# EAGLE design QuadStepDriver (EAGLE 6.4)

## Sheet 1 of 5
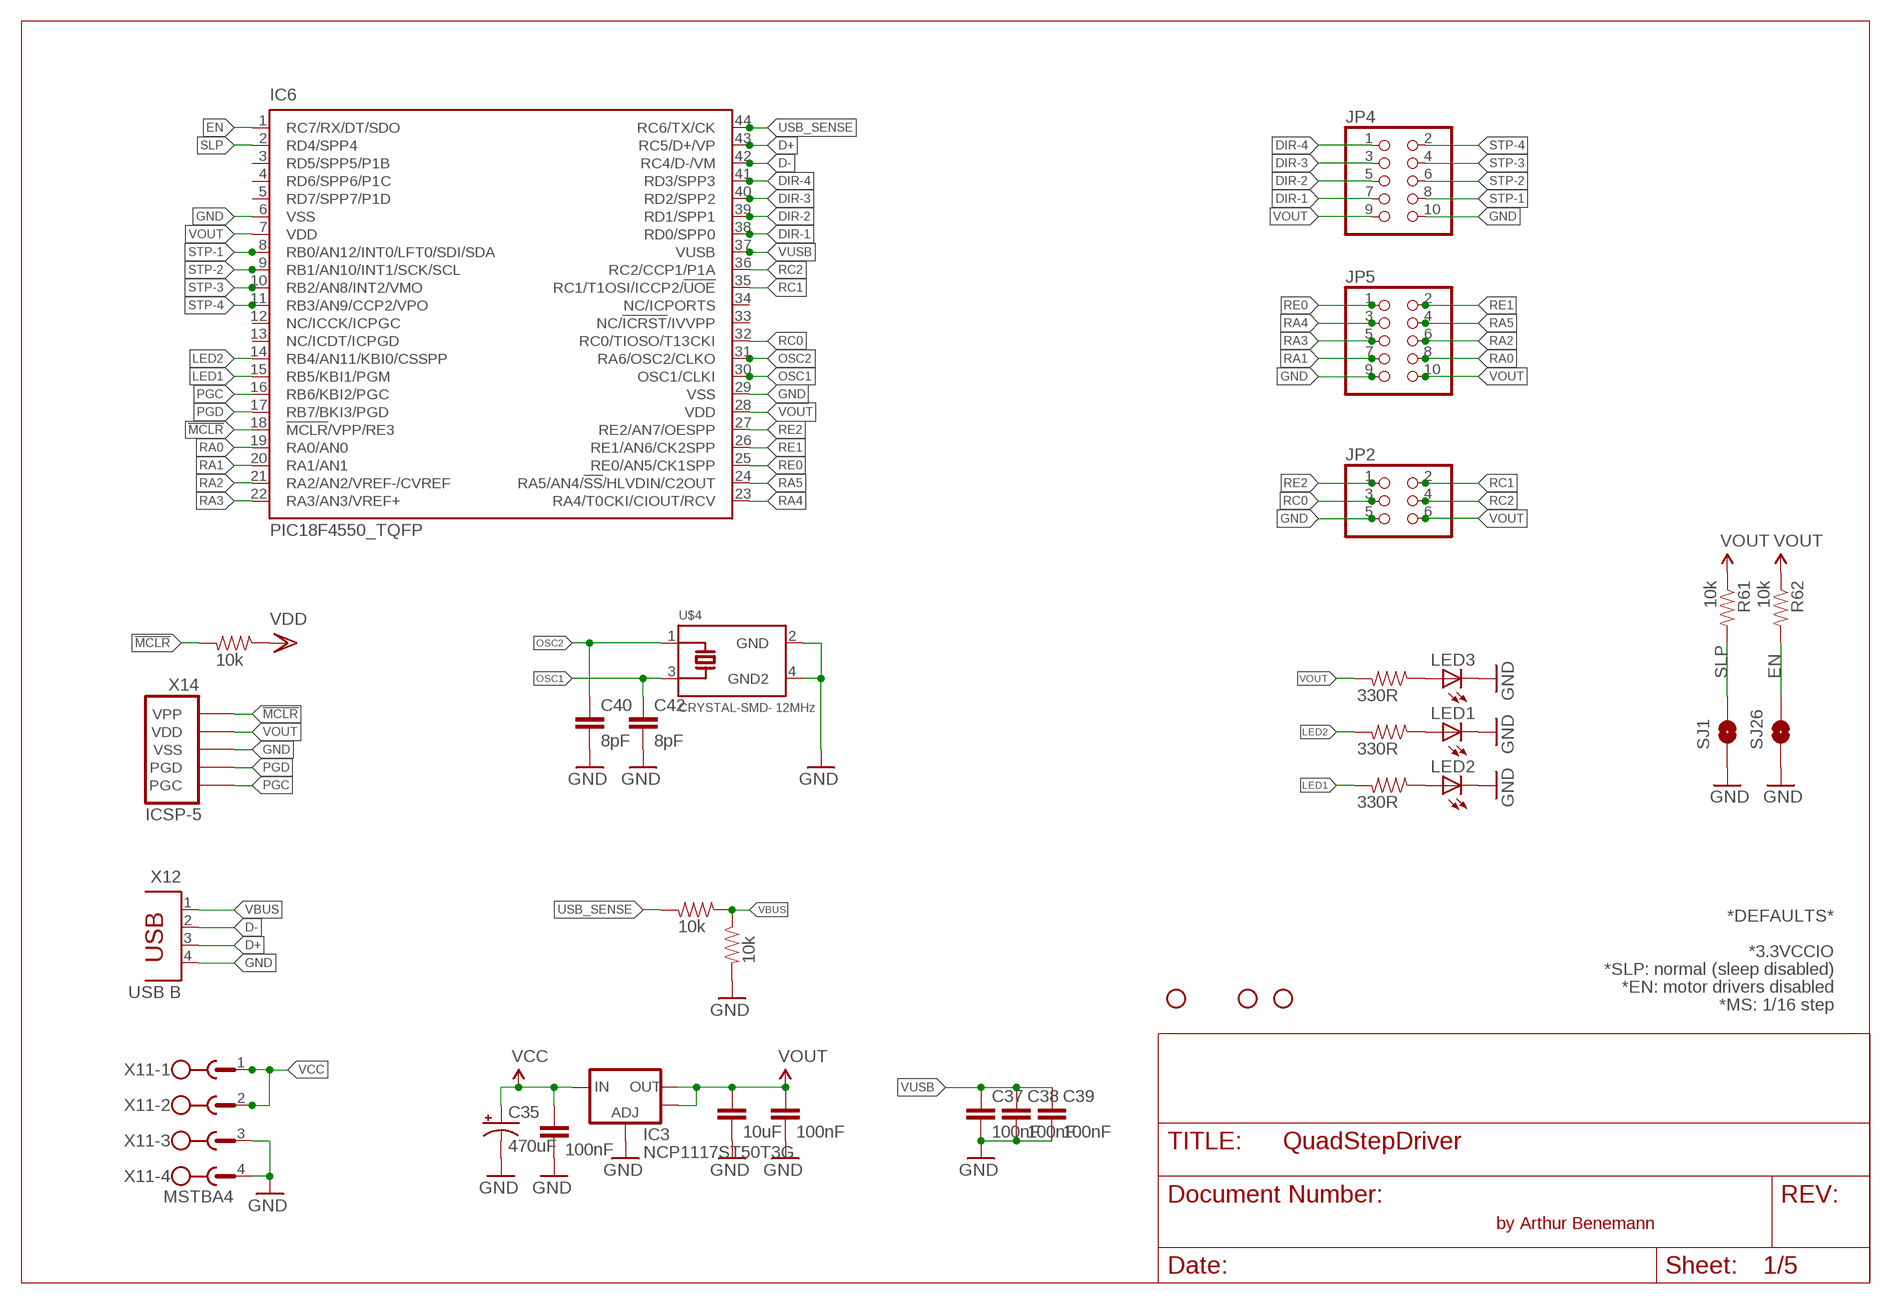
[diagram p0: schematic, sheet 1]

### Parts
C33  10uF  CAP0805  [0805]
C34  100nF  CAP0805  [0805]
C35  470uF  CAP_POLG  [PANASONIC_G]
C36  100nF  CAP0805  [0805]
C37  100nF  CAP0805  [0805]
C38  100nF  CAP0805  [0805]
C39  100nF  CAP0805  [0805]
C40  8pF  CAP0603-CAP  [0603-CAP]
C42  8pF  CAP0603-CAP  [0603-CAP]
IC3  NCP1117ST50T3G  V_REG_LM1117SOT223  [SOT223]
IC6  PIC18F4550_TQFP  [TQFP44]
JP2  PINHD-2X3  [2X03]
JP4  PINHD-2X5  [2X05]
JP5  PINHD-2X5  [2X05]
JP9  STAND-OFF  [STAND-OFF]
JP10  STAND-OFF  [STAND-OFF]
JP12  STAND-OFF  [STAND-OFF]
LED1  LEDCHIPLED_0805  [CHIPLED_0805]
LED2  LEDCHIPLED_0805  [CHIPLED_0805]
LED3  LEDCHIPLED_0805  [CHIPLED_0805]
R33  330R  RESISTOR  [0805]
R34  330R  RESISTOR  [0805]
R35  330R  RESISTOR  [0805]
R49  10k  RESISTOR  [0805]
R50  10k  RESISTOR  [0805]
R51  10k  RESISTOR  [0805]
R61  10k  RESISTOR0603-RES  [0603-RES]
R62  10k  RESISTOR0603-RES  [0603-RES]
SJ1  SOLDERJUMPERNO  [SJ_2S-NO]
SJ26  SOLDERJUMPERNO  [SJ_2S-NO]
U$4  CRYSTAL-SMD- 12MHz  CRYSTAL-SMD  [CRYSTAL-SMD-3.2X2.5]
X11  MSTBA4  [MSTBA4]
X12  USB B  PN61729  [PN61729]
X14  ICSP-5  [M05]

### Nets
!MCLR: IC6.18(!MCLR!/VPP/RE3) R51.2 X14.1(VPP)
D+: IC6.43(RC5/D+/VP) X12.3
D-: IC6.42(RC4/D-/VM) X12.2
DIR-1: IC6.38(RD0/SPP0) JP4.7 ; also sheet 2
DIR-2: IC6.39(RD1/SPP1) JP4.5 ; also sheet 3
DIR-3: IC6.40(RD2/SPP2) JP4.3 ; also sheet 4
DIR-4: IC6.41(RD3/SPP3) JP4.1 ; also sheet 5
EN: IC6.1(RC7/RX/DT/SDO) R62.2 SJ26.2 ; also sheet 2,3,4,5
GND: C33.1 C34.1 C35.- C36.1 C37.2 C38.2 C39.2 C40.2 C42.2 IC3.1(ADJ) IC6.6(VSS) IC6.29(VSS) JP2.5 JP4.10 JP5.9 LED1.C LED2.C LED3.C R50.2 SJ1.1 SJ26.1 U$4.2(GND) U$4.4(GND2) X11.3 X11.4 X12.4 X14.3(VSS) ; also sheet 2,3,4,5
LED1: IC6.15(RB5/KBI1/PGM) R34.2
LED2: IC6.14(RB4/AN11/KBI0/CSSPP) R33.2
N$27: LED3.A R35.1
N$54: LED1.A R33.1
N$73: LED2.A R34.1
OSC1: C42.1 IC6.30(OSC1/CLKI) U$4.3(OSC2)
OSC2: C40.1 IC6.31(RA6/OSC2/CLKO) U$4.1(OSC1)
PGC: IC6.16(RB6/KBI2/PGC) X14.5(PGC)
PGD: IC6.17(RB7/BKI3/PGD) X14.4(PGD)
RA0: IC6.19(RA0/AN0) JP5.8
RA1: IC6.20(RA1/AN1) JP5.7
RA2: IC6.21(RA2/AN2/VREF-/CVREF) JP5.6
RA3: IC6.22(RA3/AN3/VREF+) JP5.5
RA4: IC6.23(RA4/T0CKI/CIOUT/RCV) JP5.3
RA5: IC6.24(RA5/AN4/!SS!/HLVDIN/C2OUT) JP5.4
RC0: IC6.32(RC0/TIOSO/T13CKI) JP2.3
RC1: IC6.35(RC1/T1OSI/ICCP2/!UOE) JP2.2
RC2: IC6.36(RC2/CCP1/P1A) JP2.4
RE0: IC6.25(RE0/AN5/CK1SPP) JP5.1
RE1: IC6.26(RE1/AN6/CK2SPP) JP5.2
RE2: IC6.27(RE2/AN7/OESPP) JP2.1
SLP: IC6.2(RD4/SPP4) R61.2 SJ1.2 ; also sheet 2,3,4,5
STP-1: IC6.8(RB0/AN12/INT0/LFT0/SDI/SDA) JP4.8 ; also sheet 2
STP-2: IC6.9(RB1/AN10/INT1/SCK/SCL) JP4.6 ; also sheet 3
STP-3: IC6.10(RB2/AN8/INT2/VMO) JP4.4 ; also sheet 4
STP-4: IC6.11(RB3/AN9/CCP2/VPO) JP4.2 ; also sheet 5
USB_SENSE: IC6.44(RC6/TX/CK) R49.2
VBUS: R49.1 R50.1 X12.1
VCC: C35.+ C36.2 IC3.3(IN) X11.1 X11.2 ; also sheet 2,3,4,5
VOUT: C33.2 C34.2 IC3.2(OUT) IC3.4(OUT) IC6.7(VDD) IC6.28(VDD) JP2.6 JP4.9 JP5.10 R35.2 R51.1 R61.1 R62.1 X14.2(VDD) ; supply symbol labelled VDD ; also sheet 2,3,4,5
VUSB: C37.1 C38.1 C39.1 IC6.37(VUSB)
Unconnected: IC6.3(RD5/SPP5/P1B) IC6.4(RD6/SPP6/P1C) IC6.5(RD7/SPP7/P1D) IC6.12(NC/ICCK/ICPGC) IC6.13(NC/ICDT/ICPGD) IC6.33(NC/!ICRST!/IVVPP) IC6.34(NC/ICPORTS)

### Notes on the sheet
- *DEFAULTS*
- *3.3VCCIO
- *SLP: normal (sleep disabled)
- *EN: motor drivers disabled
- *MS: 1/16 step
- by Arthur Benemann

## Sheet 2 of 5
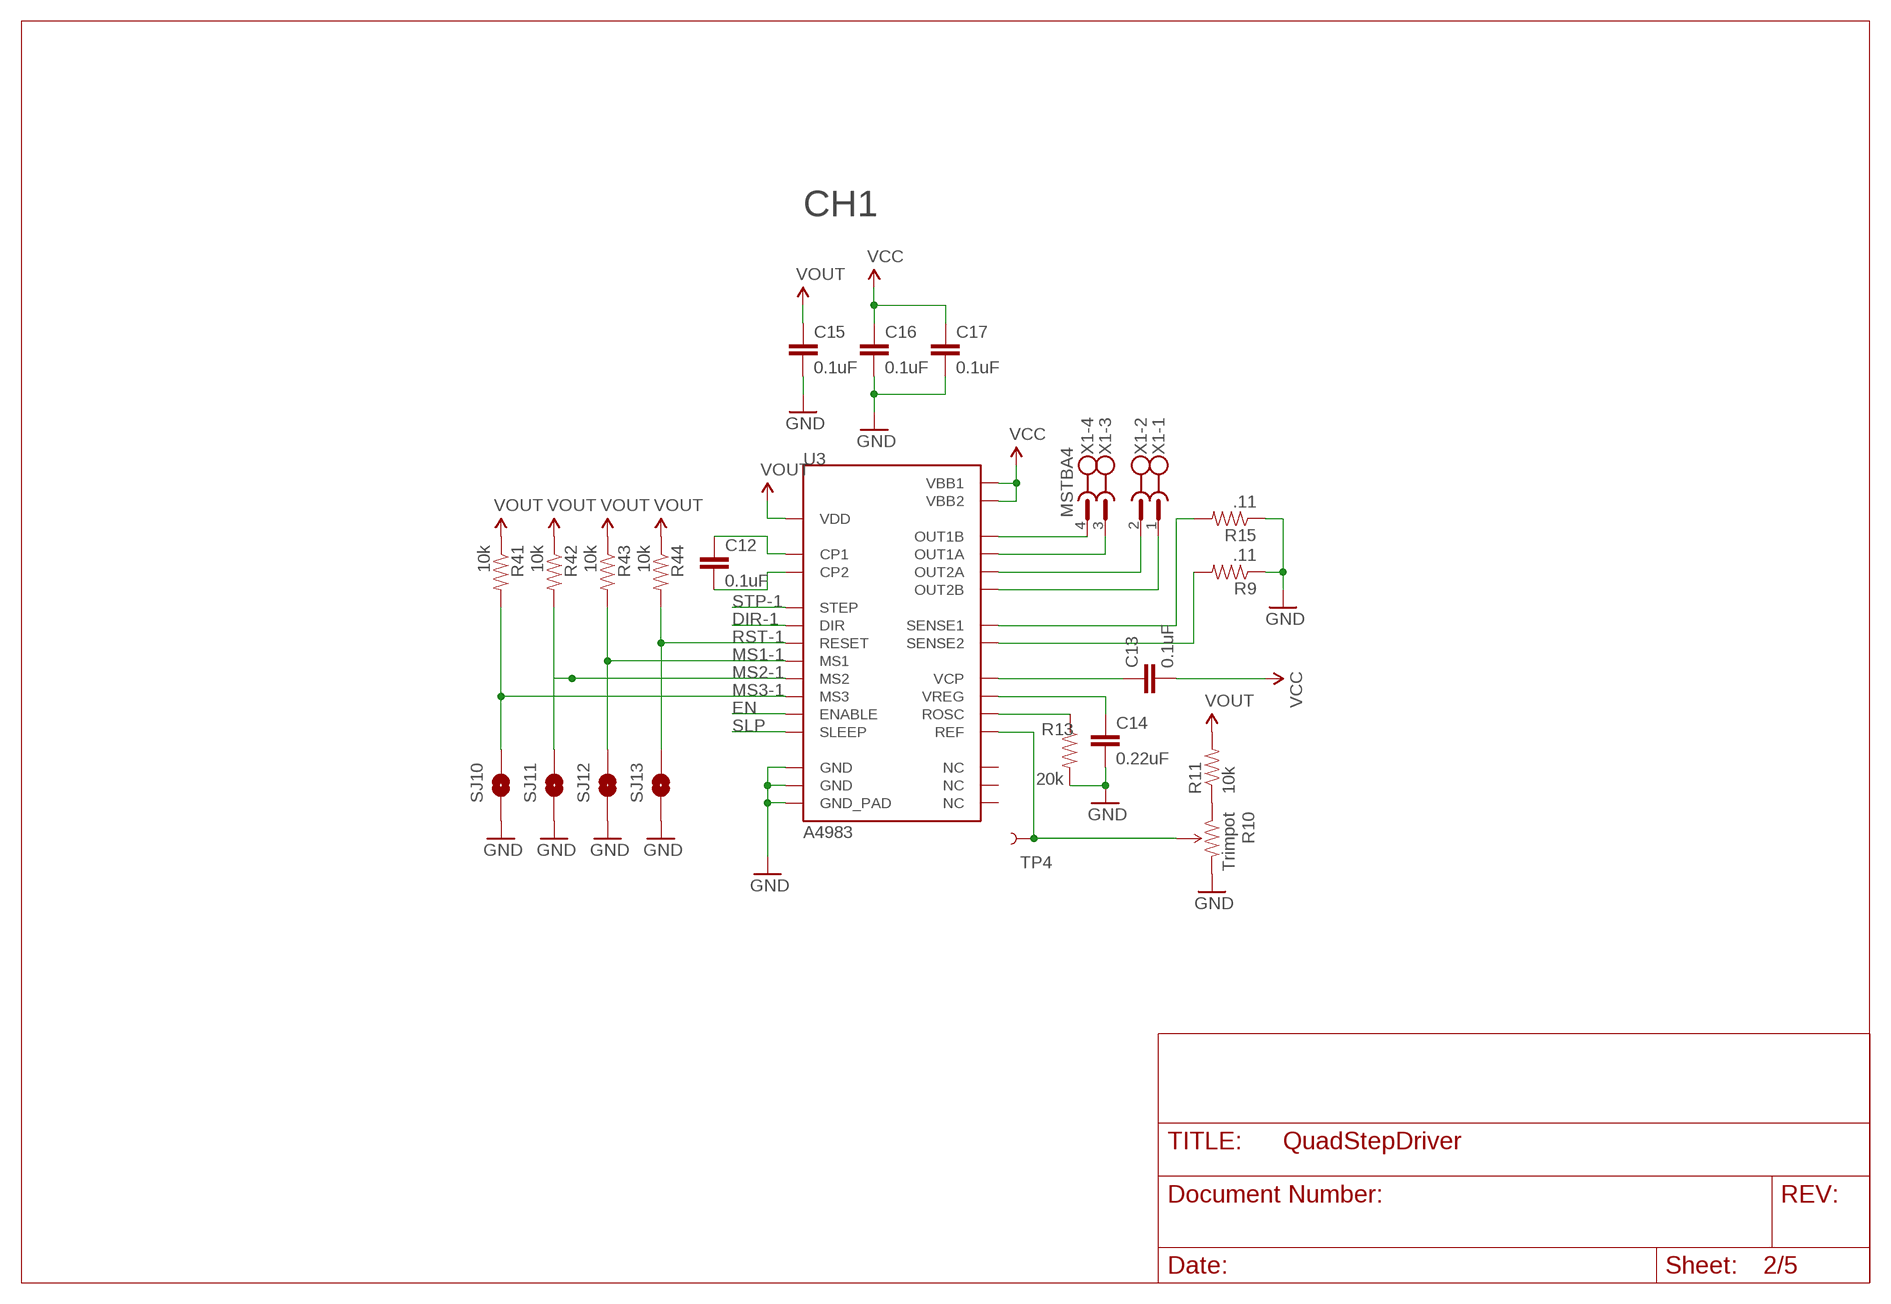
[diagram p1: schematic, sheet 2]

### Parts
C12  0.1uF  CAP0603-CAP  [0603-CAP]
C13  0.1uF  CAP0603-CAP  [0603-CAP]
C14  0.22uF  CAP0603-CAP  [0603-CAP]
C15  0.1uF  CAP0603-CAP  [0603-CAP]
C16  0.1uF  CAP0603-CAP  [0603-CAP]
C17  0.1uF  CAP0603-CAP  [0603-CAP]
R9  .11  RESISTOR2010  [R2010]
R10  Trimpot  TRIMPOTSMD  [TRIMPOT-3MM]
R11  10k  RESISTOR0603-RES  [0603-RES]
R13  20k  RESISTOR0603-RES  [0603-RES]
R15  .11  RESISTOR2010  [R2010]
R41  10k  RESISTOR0603-RES  [0603-RES]
R42  10k  RESISTOR0603-RES  [0603-RES]
R43  10k  RESISTOR0603-RES  [0603-RES]
R44  10k  RESISTOR0603-RES  [0603-RES]
SJ10  SOLDERJUMPERNO  [SJ_2S-NO]
SJ11  SOLDERJUMPERNO  [SJ_2S-NO]
SJ12  SOLDERJUMPERNO  [SJ_2S-NO]
SJ13  SOLDERJUMPERNO  [SJ_2S-NO]
TP4  TEST-POINT3X5  [PAD.03X.05]
U3  A4983  [QFN-28-5MM]
X1  MSTBA4  [MSTBA4]

### Nets
DIR-1: U3.P$19(DIR) ; also sheet 1
EN: U3.P$2(ENABLE) ; also sheet 1,3,4,5
GND: C14.2 C15.2 C16.2 C17.2 R9.1 R10.3(CW) R13.2 R15.1 SJ10.1 SJ11.1 SJ12.1 SJ13.1 U3.P$3(GND) U3.P$18(GND) U3.P$29(GND_PAD) ; also sheet 1,3,4,5
MS1-1: R43.2 SJ12.2 U3.P$9(MS1)
MS2-1: R42.2 SJ11.2 U3.P$10(MS2)
MS3-1: R41.2 SJ10.2 U3.P$11(MS3)
N$1: R9.2 U3.P$27(SENSE2)
N$4: R15.2 U3.P$23(SENSE1)
N$5: R10.1(CCW) R11.1
N$19: C13.1 U3.P$6(VCP)
N$20: C14.1 U3.P$8(VREG)
N$21: R13.1 U3.P$13(ROSC)
N$22: R10.2(WIPER) TP4.P$1 U3.P$17(REF)
N$23: C12.1 U3.P$4(CP1)
N$25: C12.2 U3.P$5(CP2)
N$28: U3.P$21(OUT1B) X1.4
N$29: U3.P$24(OUT1A) X1.3
N$30: U3.P$26(OUT2A) X1.2
N$31: U3.P$1(OUT2B) X1.1
RST-1: R44.2 SJ13.2 U3.P$12(RESET)
SLP: U3.P$14(SLEEP) ; also sheet 1,3,4,5
STP-1: U3.P$16(STEP) ; also sheet 1
VCC: C13.2 C16.1 C17.1 U3.P$22(VBB1) U3.P$28(VBB2) ; also sheet 1,3,4,5
VOUT: C15.1 R11.2 R41.1 R42.1 R43.1 R44.1 U3.P$15(VDD) ; also sheet 1,3,4,5
Unconnected: U3.P$7(NC) U3.P$20(NC) U3.P$25(NC)

### Notes on the sheet
- CH1

## Sheet 3 of 5
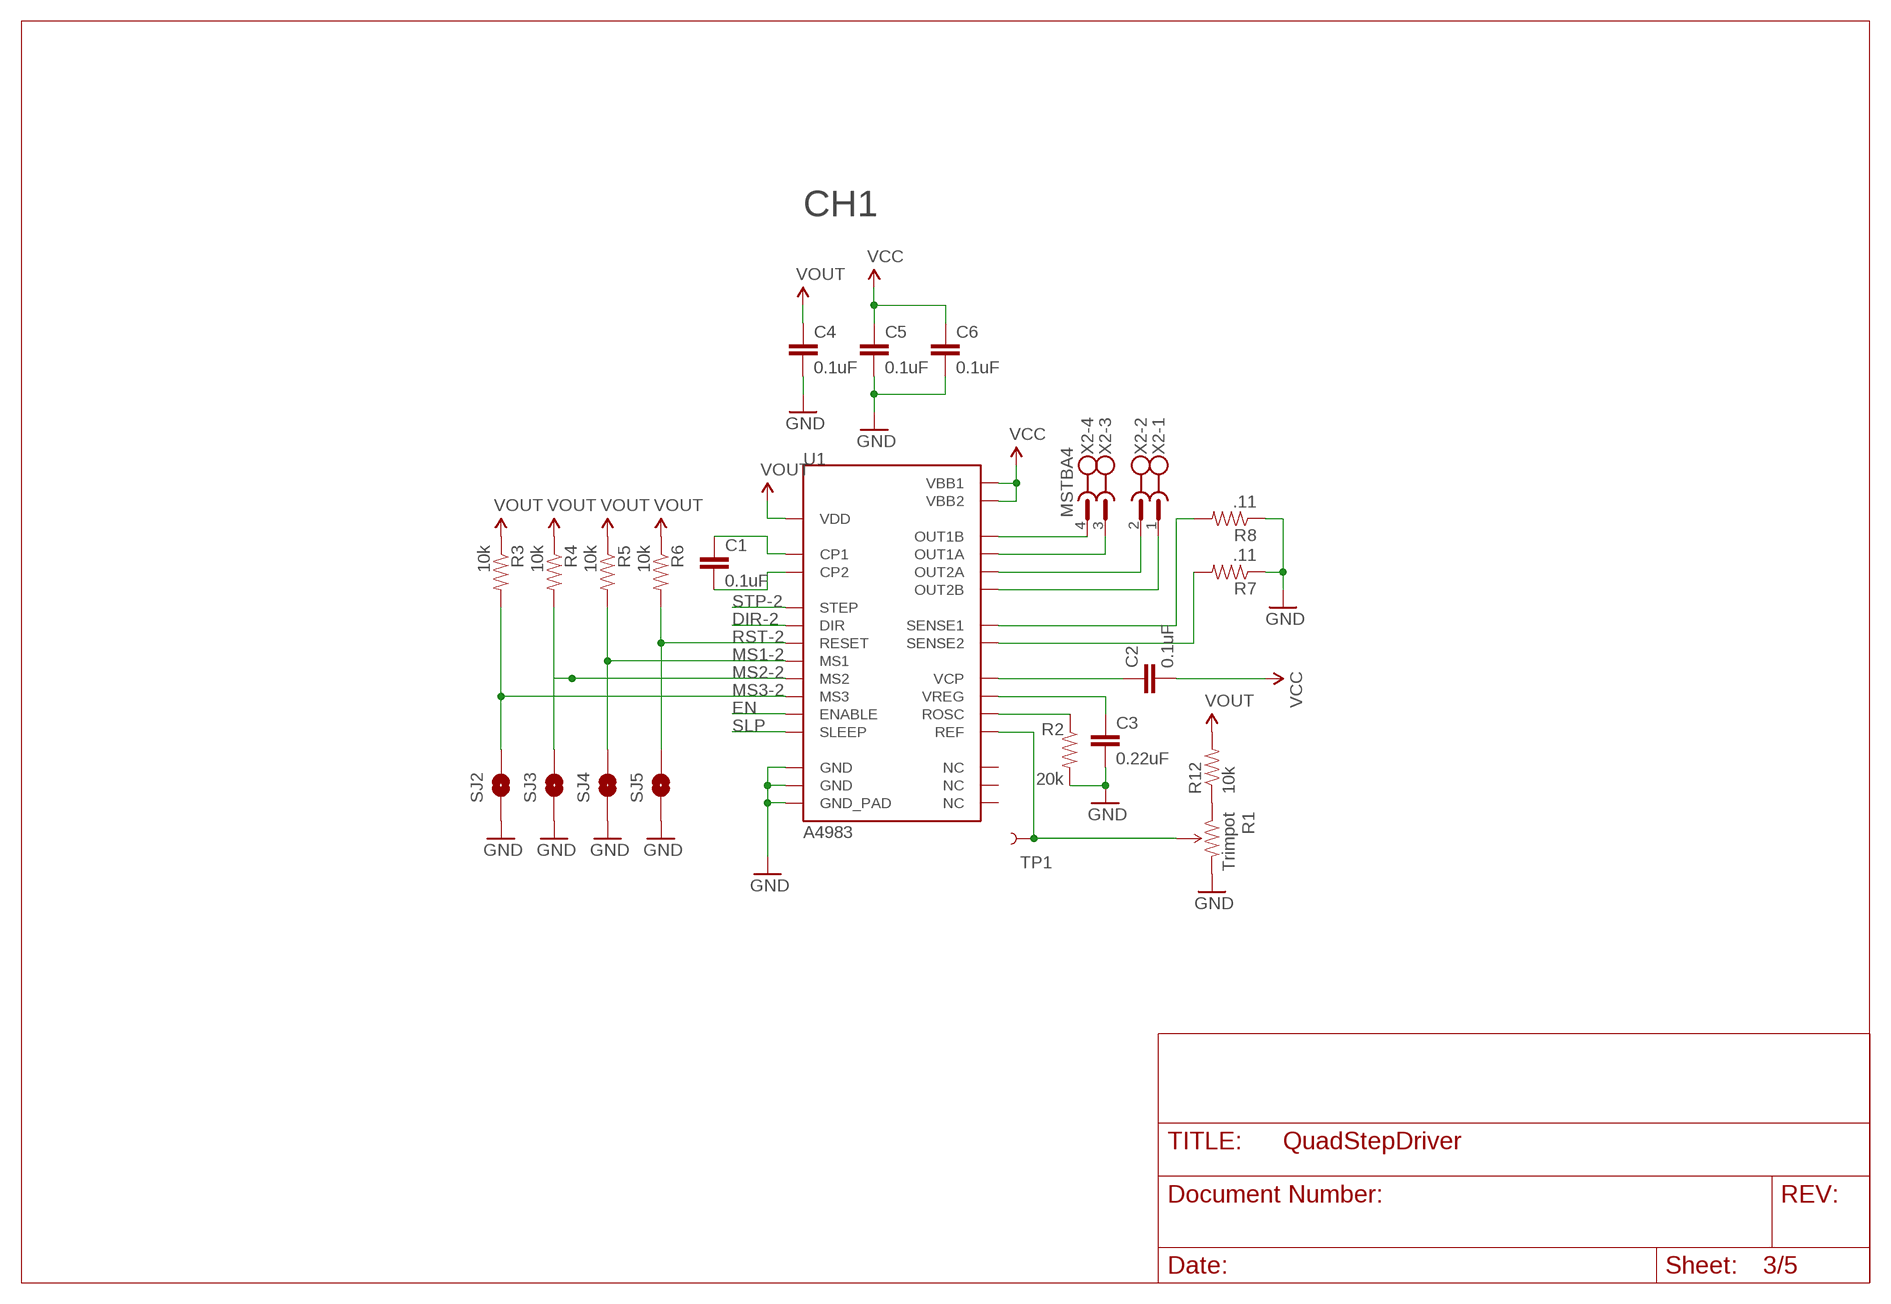
[diagram p2: schematic, sheet 3]

### Parts
C1  0.1uF  CAP0603-CAP  [0603-CAP]
C2  0.1uF  CAP0603-CAP  [0603-CAP]
C3  0.22uF  CAP0603-CAP  [0603-CAP]
C4  0.1uF  CAP0603-CAP  [0603-CAP]
C5  0.1uF  CAP0603-CAP  [0603-CAP]
C6  0.1uF  CAP0603-CAP  [0603-CAP]
R1  Trimpot  TRIMPOTSMD  [TRIMPOT-3MM]
R2  20k  RESISTOR0603-RES  [0603-RES]
R3  10k  RESISTOR0603-RES  [0603-RES]
R4  10k  RESISTOR0603-RES  [0603-RES]
R5  10k  RESISTOR0603-RES  [0603-RES]
R6  10k  RESISTOR0603-RES  [0603-RES]
R7  .11  RESISTOR2010  [R2010]
R8  .11  RESISTOR2010  [R2010]
R12  10k  RESISTOR0603-RES  [0603-RES]
SJ2  SOLDERJUMPERNO  [SJ_2S-NO]
SJ3  SOLDERJUMPERNO  [SJ_2S-NO]
SJ4  SOLDERJUMPERNO  [SJ_2S-NO]
SJ5  SOLDERJUMPERNO  [SJ_2S-NO]
TP1  TEST-POINT3X5  [PAD.03X.05]
U1  A4983  [QFN-28-5MM]
X2  MSTBA4  [MSTBA4]

### Nets
DIR-2: U1.P$19(DIR) ; also sheet 1
EN: U1.P$2(ENABLE) ; also sheet 1,2,4,5
GND: C3.2 C4.2 C5.2 C6.2 R1.3(CW) R2.2 R7.1 R8.1 SJ2.1 SJ3.1 SJ4.1 SJ5.1 U1.P$3(GND) U1.P$18(GND) U1.P$29(GND_PAD) ; also sheet 1,2,4,5
MS1-2: R5.2 SJ4.2 U1.P$9(MS1)
MS2-2: R4.2 SJ3.2 U1.P$10(MS2)
MS3-2: R3.2 SJ2.2 U1.P$11(MS3)
N$2: C2.1 U1.P$6(VCP)
N$3: C3.1 U1.P$8(VREG)
N$6: R2.1 U1.P$13(ROSC)
N$7: R1.2(WIPER) TP1.P$1 U1.P$17(REF)
N$8: C1.1 U1.P$4(CP1)
N$9: C1.2 U1.P$5(CP2)
N$10: U1.P$24(OUT1A) X2.3
N$11: U1.P$26(OUT2A) X2.2
N$12: U1.P$1(OUT2B) X2.1
N$13: U1.P$21(OUT1B) X2.4
N$14: R7.2 U1.P$27(SENSE2)
N$15: R8.2 U1.P$23(SENSE1)
N$16: R1.1(CCW) R12.1
RST-2: R6.2 SJ5.2 U1.P$12(RESET)
SLP: U1.P$14(SLEEP) ; also sheet 1,2,4,5
STP-2: U1.P$16(STEP) ; also sheet 1
VCC: C2.2 C5.1 C6.1 U1.P$22(VBB1) U1.P$28(VBB2) ; also sheet 1,2,4,5
VOUT: C4.1 R3.1 R4.1 R5.1 R6.1 R12.2 U1.P$15(VDD) ; also sheet 1,2,4,5
Unconnected: U1.P$7(NC) U1.P$20(NC) U1.P$25(NC)

### Notes on the sheet
- CH1

## Sheet 4 of 5
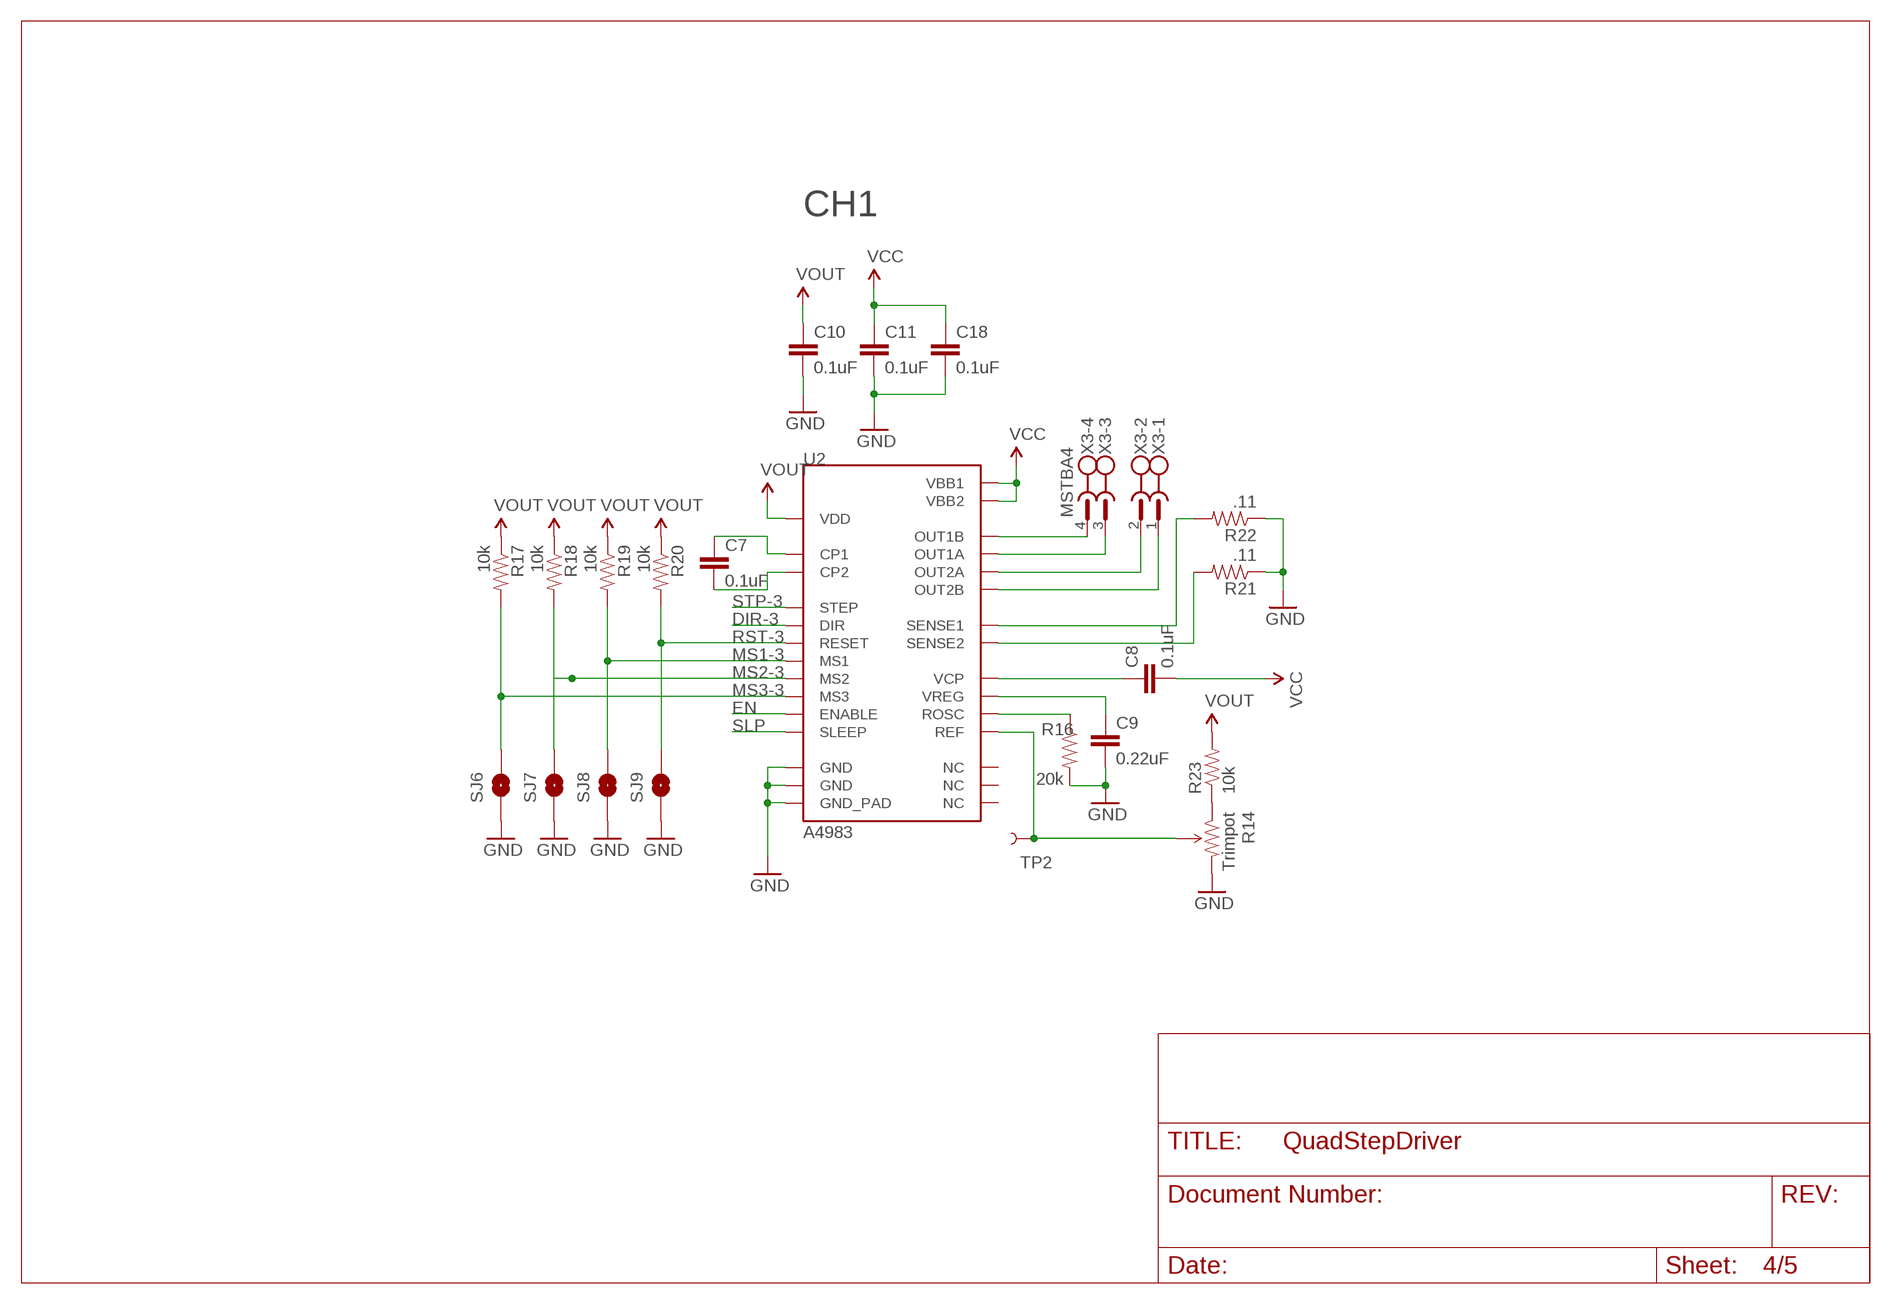
[diagram p3: schematic, sheet 4]

### Parts
C7  0.1uF  CAP0603-CAP  [0603-CAP]
C8  0.1uF  CAP0603-CAP  [0603-CAP]
C9  0.22uF  CAP0603-CAP  [0603-CAP]
C10  0.1uF  CAP0603-CAP  [0603-CAP]
C11  0.1uF  CAP0603-CAP  [0603-CAP]
C18  0.1uF  CAP0603-CAP  [0603-CAP]
R14  Trimpot  TRIMPOTSMD  [TRIMPOT-3MM]
R16  20k  RESISTOR0603-RES  [0603-RES]
R17  10k  RESISTOR0603-RES  [0603-RES]
R18  10k  RESISTOR0603-RES  [0603-RES]
R19  10k  RESISTOR0603-RES  [0603-RES]
R20  10k  RESISTOR0603-RES  [0603-RES]
R21  .11  RESISTOR2010  [R2010]
R22  .11  RESISTOR2010  [R2010]
R23  10k  RESISTOR0603-RES  [0603-RES]
SJ6  SOLDERJUMPERNO  [SJ_2S-NO]
SJ7  SOLDERJUMPERNO  [SJ_2S-NO]
SJ8  SOLDERJUMPERNO  [SJ_2S-NO]
SJ9  SOLDERJUMPERNO  [SJ_2S-NO]
TP2  TEST-POINT3X5  [PAD.03X.05]
U2  A4983  [QFN-28-5MM]
X3  MSTBA4  [MSTBA4]

### Nets
DIR-3: U2.P$19(DIR) ; also sheet 1
EN: U2.P$2(ENABLE) ; also sheet 1,2,3,5
GND: C9.2 C10.2 C11.2 C18.2 R14.3(CW) R16.2 R21.1 R22.1 SJ6.1 SJ7.1 SJ8.1 SJ9.1 U2.P$3(GND) U2.P$18(GND) U2.P$29(GND_PAD) ; also sheet 1,2,3,5
MS1-3: R19.2 SJ8.2 U2.P$9(MS1)
MS2-3: R18.2 SJ7.2 U2.P$10(MS2)
MS3-3: R17.2 SJ6.2 U2.P$11(MS3)
N$17: C8.1 U2.P$6(VCP)
N$18: C9.1 U2.P$8(VREG)
N$24: R16.1 U2.P$13(ROSC)
N$26: R14.2(WIPER) TP2.P$1 U2.P$17(REF)
N$32: C7.1 U2.P$4(CP1)
N$33: C7.2 U2.P$5(CP2)
N$34: U2.P$24(OUT1A) X3.3
N$35: U2.P$26(OUT2A) X3.2
N$36: U2.P$1(OUT2B) X3.1
N$37: U2.P$21(OUT1B) X3.4
N$38: R21.2 U2.P$27(SENSE2)
N$39: R22.2 U2.P$23(SENSE1)
N$40: R14.1(CCW) R23.1
RST-3: R20.2 SJ9.2 U2.P$12(RESET)
SLP: U2.P$14(SLEEP) ; also sheet 1,2,3,5
STP-3: U2.P$16(STEP) ; also sheet 1
VCC: C8.2 C11.1 C18.1 U2.P$22(VBB1) U2.P$28(VBB2) ; also sheet 1,2,3,5
VOUT: C10.1 R17.1 R18.1 R19.1 R20.1 R23.2 U2.P$15(VDD) ; also sheet 1,2,3,5
Unconnected: U2.P$7(NC) U2.P$20(NC) U2.P$25(NC)

### Notes on the sheet
- CH1

## Sheet 5 of 5
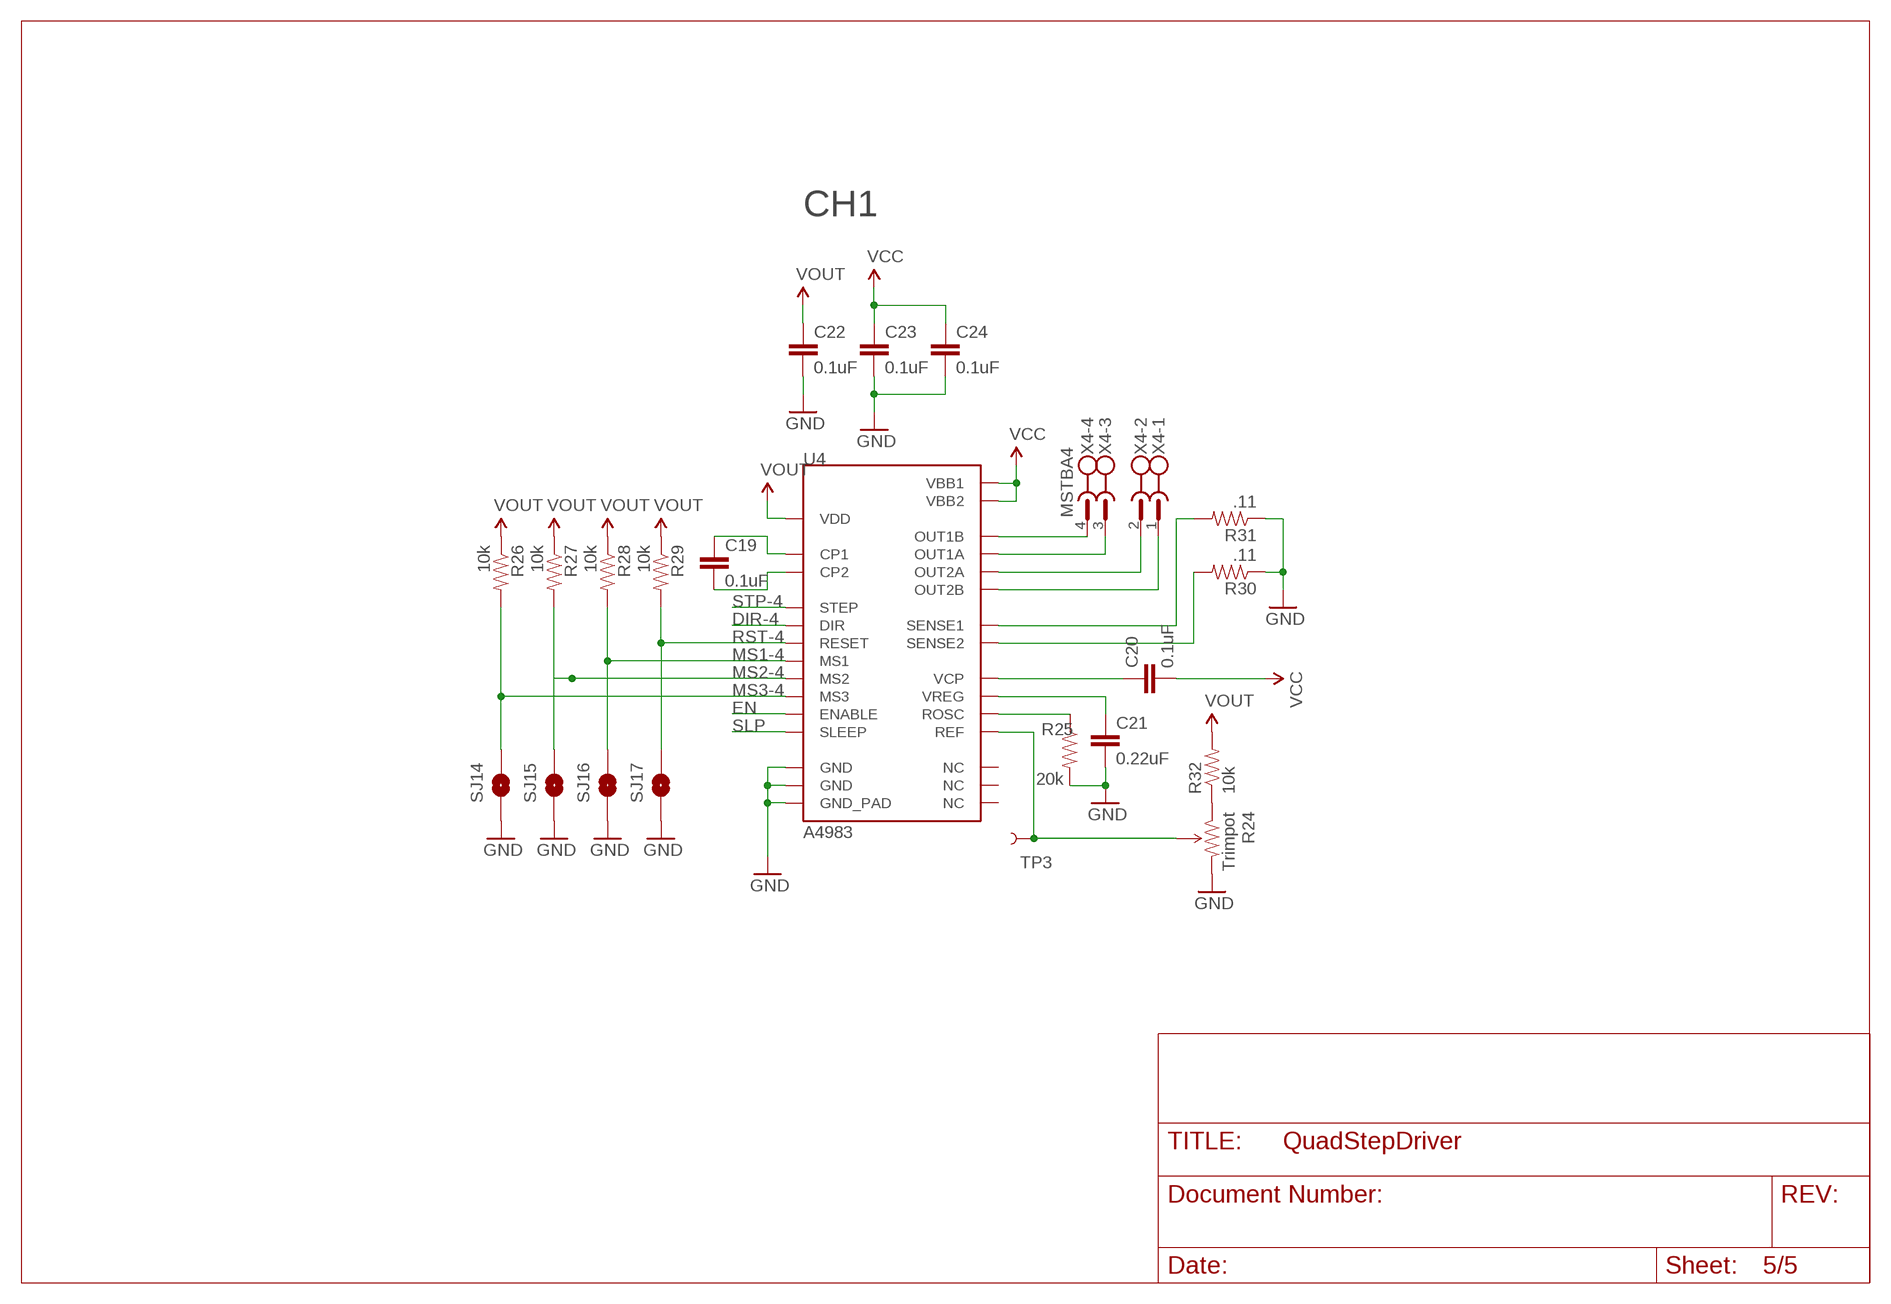
[diagram p4: schematic, sheet 5]

### Parts
C19  0.1uF  CAP0603-CAP  [0603-CAP]
C20  0.1uF  CAP0603-CAP  [0603-CAP]
C21  0.22uF  CAP0603-CAP  [0603-CAP]
C22  0.1uF  CAP0603-CAP  [0603-CAP]
C23  0.1uF  CAP0603-CAP  [0603-CAP]
C24  0.1uF  CAP0603-CAP  [0603-CAP]
R24  Trimpot  TRIMPOTSMD  [TRIMPOT-3MM]
R25  20k  RESISTOR0603-RES  [0603-RES]
R26  10k  RESISTOR0603-RES  [0603-RES]
R27  10k  RESISTOR0603-RES  [0603-RES]
R28  10k  RESISTOR0603-RES  [0603-RES]
R29  10k  RESISTOR0603-RES  [0603-RES]
R30  .11  RESISTOR2010  [R2010]
R31  .11  RESISTOR2010  [R2010]
R32  10k  RESISTOR0603-RES  [0603-RES]
SJ14  SOLDERJUMPERNO  [SJ_2S-NO]
SJ15  SOLDERJUMPERNO  [SJ_2S-NO]
SJ16  SOLDERJUMPERNO  [SJ_2S-NO]
SJ17  SOLDERJUMPERNO  [SJ_2S-NO]
TP3  TEST-POINT3X5  [PAD.03X.05]
U4  A4983  [QFN-28-5MM]
X4  MSTBA4  [MSTBA4]

### Nets
DIR-4: U4.P$19(DIR) ; also sheet 1
EN: U4.P$2(ENABLE) ; also sheet 1,2,3,4
GND: C21.2 C22.2 C23.2 C24.2 R24.3(CW) R25.2 R30.1 R31.1 SJ14.1 SJ15.1 SJ16.1 SJ17.1 U4.P$3(GND) U4.P$18(GND) U4.P$29(GND_PAD) ; also sheet 1,2,3,4
MS1-4: R28.2 SJ16.2 U4.P$9(MS1)
MS2-4: R27.2 SJ15.2 U4.P$10(MS2)
MS3-4: R26.2 SJ14.2 U4.P$11(MS3)
N$41: C20.1 U4.P$6(VCP)
N$42: C21.1 U4.P$8(VREG)
N$43: R25.1 U4.P$13(ROSC)
N$44: R24.2(WIPER) TP3.P$1 U4.P$17(REF)
N$45: C19.1 U4.P$4(CP1)
N$46: C19.2 U4.P$5(CP2)
N$47: U4.P$24(OUT1A) X4.3
N$48: U4.P$26(OUT2A) X4.2
N$49: U4.P$1(OUT2B) X4.1
N$50: U4.P$21(OUT1B) X4.4
N$51: R30.2 U4.P$27(SENSE2)
N$52: R31.2 U4.P$23(SENSE1)
N$53: R24.1(CCW) R32.1
RST-4: R29.2 SJ17.2 U4.P$12(RESET)
SLP: U4.P$14(SLEEP) ; also sheet 1,2,3,4
STP-4: U4.P$16(STEP) ; also sheet 1
VCC: C20.2 C23.1 C24.1 U4.P$22(VBB1) U4.P$28(VBB2) ; also sheet 1,2,3,4
VOUT: C22.1 R26.1 R27.1 R28.1 R29.1 R32.2 U4.P$15(VDD) ; also sheet 1,2,3,4
Unconnected: U4.P$7(NC) U4.P$20(NC) U4.P$25(NC)

### Notes on the sheet
- CH1

## Library data of the parts
C1-C24 C33 C34 C36-C40 C42 = SparkFun:CAP: Capacitor Standard 0603 ceramic capacitor, and 0.1" leaded capacitor.
C35 = SparkFun:CAP_POL: Capacitor Polarized These are standard SMD and PTH capacitors. Normally 10uF, 47uF, and 100uF in electrolytic and tantalum varieties. Always verify the external diameter of the through hole cap, it varies with capacity, voltage, and manufacturer. The EIA devices should be standard.
IC3 = SparkFun:V_REG_LM1117: Voltage Regulator LM1117 Standard adjustable voltage regulator but in SMD form. Spark Fun Electronics SKU : COM-00595
IC6 = microchip:PIC18F4*_TQFP: USB Microcontrollers with nanoWatt Technology High-Performance, Enhanced Flash, 28/40/44-Pin, Source: http://ww1.microchip.com/downloads/en/devicedoc/39632c.pdf; MF: MICROCHIP; MPN: PIC18F4550-I/PT; OC_FARNELL: 9321365; OC_NEWARK: 08J9633
JP2 = pinhead:PINHD-2X3: PIN HEADER
JP4 JP5 = pinhead:PINHD-2X5: PIN HEADER
JP9 JP10 JP12 = SparkFun:STAND-OFF: Stand Off This is the mechanical footprint for a #4 phillips button head screw. Use the keepout ring to avoid running the screw head into surrounding components. SKU : PRT-00447
LED1-LED3 = led:LED: LED OSRAM: - CHIPLED LG R971, LG N971, LY N971, LG Q971, LY Q971, LO R971, LY R971 LH N974, LH R974 LS Q976, LO Q976, LY Q976 LO Q996 - Hyper CHIPLED LW Q18S LB Q993, LB Q99A, LB R99A - SideLED LS A670, LO A670, LY A670, LG A670, LP A670 LB A673, LV A673, LT A673, LW A673 LH A674 LY A675 LS A676, LA A676, LO A676, LY A676, LW A676 LS A679, LY A679, LG A679 - Hyper Micro SIDELED® LS Y876, LA Y876, LO Y876, LY Y876 LT Y87S - SmartLED LW L88C, LW L88S LB L89C, LB L89S, LG L890 LS L89K, LO L89K, LY L89K LS L896, LA L896, LO L896, LY L896 - TOPLED LS T670, LO T670, LY T670, LG T670, LP T670 LSG T670, LSP T670, LSY T670, LOP T670, LYG T670 LG T671, LOG T671, LSG T671 LB T673, LV T673, LT T673, LW T673 LH T674 LS T676, LA T676, LO T676, LY T676, LB T676, LH T676, LSB T676, LW T676 LB T67C, LV T67C, LT T67C, LS T67K, LO T67K, LY T67K, LW E67C LS E67B, LA E67B, LO E67B, LY E67B, LB E67C, LV E67C, LT E67C LW T67C LS T679, LY T679, LG T679 LS T770, LO T770, LY T770, LG T770, LP T770 LB T773, LV T773, LT T773, LW T773 LH T774 LS E675, LA E675, LY E675, LS T675 LS T776, LA T776, LO T776, LY T776, LB T776 LHGB T686 LT T68C, LB T68C - Hyper Mini TOPLED® LB M676 - Mini TOPLED Santana® LG M470 LS M47K, LO M47K, LY M47K Source: http://www.osram.convergy.de LUXEON: - LUMILED® LXK2-PW12-R00, LXK2-PW12-S00, LXK2-PW14-U00, LXK2-PW14-V00 LXK2-PM12-R00, LXK2-PM12-S00, LXK2-PM14-U00 LXK2-PE12-Q00, LXK2-PE12-R00, LXK2-PE12-S00, LXK2-PE14-T00, LXK2-PE14-U00 LXK2-PB12-K00, LXK2-PB12-L00, LXK2-PB12-M00, LXK2-PB14-N00, LXK2-PB14-P00, LXK2-PB14-Q00 LXK2-PR12-L00, LXK2-PR12-M00, LXK2-PR14-Q00, LXK2-PR14-R00 LXK2-PD12-Q00, LXK2-PD12-R00, LXK2-PD12-S00 LXK2-PH12-R00, LXK2-PH12-S00 LXK2-PL12-P00, LXK2-PL12-Q00, LXK2-PL12-R00 Source: www.luxeon.com KINGBRIGHT: KA-3528ASYC Source: www.kingbright.com
R1 R10 R14 R24 = SparkFun:TRIMPOT
R2-R9 R11-R13 R15-R23 R25-R35 R41-R44 R49-R51 R61 R62 = SparkFun:RESISTOR: Resistor Basic schematic elements and footprints for 0603, 1206, and PTH 1/10th watt (small) resistors.
SJ1-SJ17 SJ26 = SparkFun:SOLDERJUMPER: Solder Jumper Standard SMD solder jumper. Used to automate production. Two varients : Normally Open and Normally Closed are the same, but have different paste layers. NC will have a large amount of paste and should jumper during reflow.
TP1-TP4 = SparkFun:TEST-POINT
U1-U4 = SparkFun:A4983: DMOS Microstepping Driver with Translator
U$4 = crystal:CRYSTAL-SMD
X1-X4 X11 = con-phoenix-508:MSTBA4: PHOENIX; MF: FARNELL; MPN: 1757268; OC_FARNELL: 3705195; OC_NEWARK: 71C4163
X12 = con-berg:PN61729: BERG USB connector; OC_FARNELL: unknown; OC_NEWARK: unknown
X14 = ICSP:ICSP-5

## Net classes
1 HV: width 1.27 mm, clearance 2.032 mm to class 0, clearance 2.032 mm

## Board
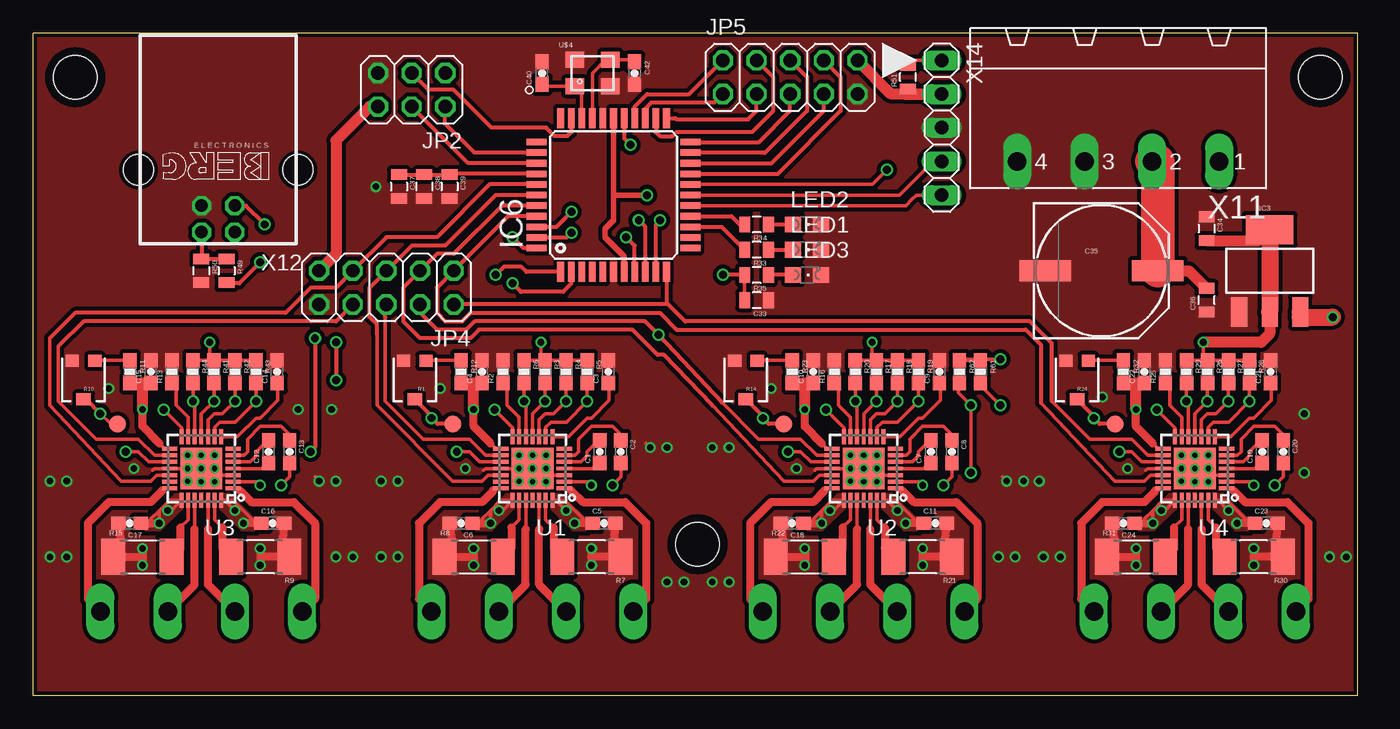
[diagram p5: board, top side]
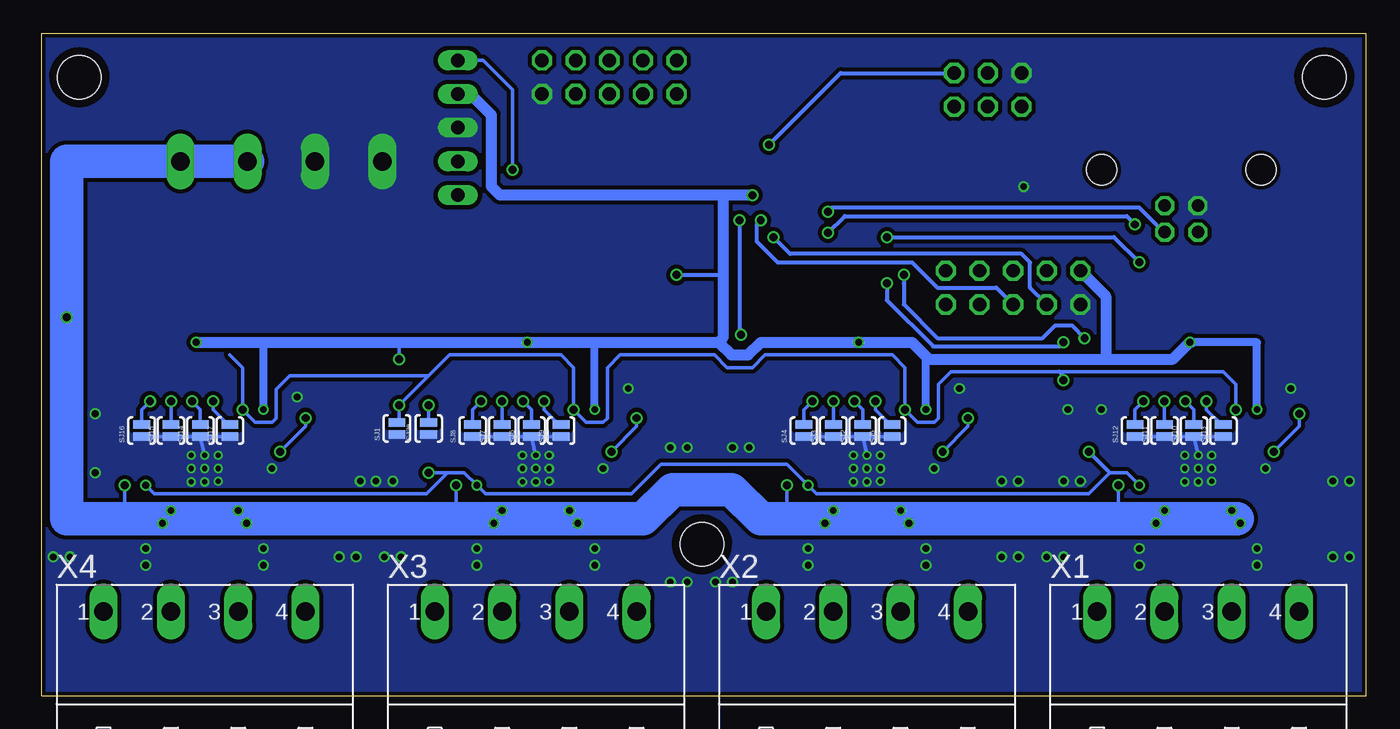
[diagram p6: board, bottom side, seen from below]

Size 100 x 50 mm. Coordinates in mm from the lower left corner, seen from the top.
Outline: 100,50 0,50 0,0 100,0 100,50
Copper layers (1*16): Top 0.035mm / dielectric 0.2mm / Bottom 0.035mm
Design rules "SeeedStudio_DRU_no_angle_20130527 *": minimum track width 6mil, minimum drill 12mil, track to track 6mil, track to pad 6mil, pad to pad 6mil, via to via 6mil, smd to smd 0mil, copper to edge 10mil, drill to drill 10mil, minimum pad ring 6mil, minimum via ring 6mil, stop-mask expansion 2mil, vias tented up to drill 25mil, thermal gap 10mil

### Footprints (pad centres in the part's own frame; a part is rotated, then mirrored left to right if it is on the bottom)
0603-CAP = smd 1.1 x 1: 1 -0.85,0; 2 0.85,0
0805 = smd 0.8 x 1.2: 1 -0.9,0; 2 0.9,0
PANASONIC_G = smd 3.9 x 1.6: + 4.25,0; - -4.25,0
SOT223 = smd 1.219 x 2.235: 1 -2.311,-3.099; 2 0,-3.099; 3 2.311,-3.099 | smd 3.6 x 2.2: 4 0,3.099
TQFP44 = smd 1.5 x 0.5: 1 -5.8,4; 2 -5.8,3.2; 3 -5.8,2.4; 4 -5.8,1.6; 5 -5.8,0.8; 6 -5.8,0; 7 -5.8,-0.8; 8 -5.8,-1.6; 9 -5.8,-2.4; 10 -5.8,-3.2; 11 -5.8,-4; 23 5.8,-4; 24 5.8,-3.2; 25 5.8,-2.4; 26 5.8,-1.6; 27 5.8,-0.8; 28 5.8,0; 29 5.8,0.8; 30 5.8,1.6; 31 5.8,2.4; 32 5.8,3.2; 33 5.8,4 | smd 0.5 x 1.5: 12 -4,-5.8; 13 -3.2,-5.8; 14 -2.4,-5.8; 15 -1.6,-5.8; 16 -0.8,-5.8; 17 0,-5.8; 18 0.8,-5.8; 19 1.6,-5.8; 20 2.4,-5.8; 21 3.2,-5.8; 22 4,-5.8; 34 4,5.8; 35 3.2,5.8; 36 2.4,5.8; 37 1.6,5.8; 38 0.8,5.8; 39 0,5.8; 40 -0.8,5.8; 41 -1.6,5.8; 42 -2.4,5.8; 43 -3.2,5.8; 44 -4,5.8
2X03 = drill 1.016 octagon: 1 -2.54,-1.27; 2 -2.54,1.27; 3 0,-1.27; 4 0,1.27; 5 2.54,-1.27; 6 2.54,1.27
2X05 = drill 1.016 octagon: 1 -5.08,-1.27; 2 -5.08,1.27; 3 -2.54,-1.27; 4 -2.54,1.27; 5 0,-1.27; 6 0,1.27; 7 2.54,-1.27; 8 2.54,1.27; 9 5.08,-1.27; 10 5.08,1.27
STAND-OFF = hole 3.302: 0,0
CHIPLED_0805 = smd 1.2 x 1.2: A 0,-1.05; C 0,1.05
TRIMPOT-3MM = smd 1 x 0.9: 1 -0.85,-1.45; 3 0.85,-1.45 | smd 1.1 x 0.9: 2 0,1.45
0603-RES = smd 1.1 x 1: 1 -0.85,0; 2 0.85,0
R2010 = smd 1.8 x 2.7: 1 -2.2,0; 2 2.2,0
SJ_2S-NO = smd 0.635 x 1.27: 1 -0.45,0; 2 0.45,0
PAD.03X.05 = smd 1.27 x 1.27: P$1 0,0
QFN-28-5MM = smd 1.15 x 0.3: P$1 -2.4,1.5; P$2 -2.4,1; P$3 -2.4,0.5; P$4 -2.4,0; P$5 -2.4,-0.5; P$6 -2.4,-1; P$7 -2.4,-1.5; P$15 2.4,-1.5; P$16 2.4,-1; P$17 2.4,-0.5; P$18 2.4,0; P$19 2.4,0.5; P$20 2.4,1; P$21 2.4,1.5 | smd 0.3 x 1.15: P$8 -1.5,-2.4; P$9 -1,-2.4; P$10 -0.5,-2.4; P$11 0,-2.4; P$12 0.5,-2.4; P$13 1,-2.4; P$14 1.5,-2.4; P$22 1.5,2.4; P$23 1,2.4; P$24 0.5,2.4; P$25 0,2.4; P$26 -0.5,2.4; P$27 -1,2.4; P$28 -1.5,2.4 | smd 3.15 x 3.15: P$29 0,0
CRYSTAL-SMD-3.2X2.5 = smd 1.4 x 1.2: 1 -1.35,-1; 2 1.35,-1; 3 1.35,1; 4 -1.35,1
MSTBA4 = drill 1.397 long: 1 -7.62,5.08; 2 -2.54,5.08; 3 2.54,5.08; 4 7.62,5.08
PN61729 = drill 0.95 octagon: 1 1.25,4.71; 2 -1.25,4.71; 3 -1.25,2.71; 4 1.25,2.71 | hole 2.3: -6.02,0; 6.02,0
M05 = drill 1.016 long: 1 0,0; 2 2.54,0; 3 5.08,0; 4 7.62,0; 5 10.16,0

### Placement (x,y rotation side)
C1  42.78,18.41 90 top
C2  44.37,18.41 270 top
C3  43.41,24.45 90 top
C4  33.89,24.45 90 top
C5  43.1,13.02 0 top
C6  32.3,13.02 180 top
C7  67.78,18.41 90 top
C8  69.37,18.41 270 top
C9  68.42,24.45 90 top
C10  58.89,24.45 90 top
C11  68.1,13.02 0 top
C12  17.78,18.41 90 top
C13  19.37,18.41 270 top
C14  18.41,24.45 90 top
C15  8.89,24.45 90 top
C16  18.1,13.02 0 top
C17  7.3,13.02 180 top
C18  57.3,13.02 180 top
C19  92.78,18.41 90 top
C20  94.37,18.41 270 top
C21  93.42,24.45 90 top
C22  83.89,24.45 90 top
C23  93.1,13.02 0 top
C24  82.3,13.02 180 top
C33  54.61,29.84 180 top
C34  88.58,35.24 270 top
C35  80.64,32.07 0 top
C36  88.58,29.84 90 top
C37  27.62,38.42 270 top
C38  29.53,38.42 270 top
C39  31.43,38.42 270 top
C40  38.42,46.99 90 top
C42  45.4,46.99 270 top
IC3  93.34,32.07 0 top
IC6  43.81,37.78 90 top
JP2  28.57,45.72 180 top
JP4  26.67,30.8 180 top
JP5  57.15,46.67 0 top
JP9  97.16,46.67 90 top
JP10  50.16,11.43 90 top
JP12  3.17,46.67 90 top
LED1  58.42,33.66 270 top
LED2  58.42,35.56 270 top
LED3  58.42,31.75 270 top
R1  28.81,23.81 180 top
R2  35.48,24.45 90 top
R3  38.65,24.45 270 top
R4  40.24,24.45 270 top
R5  41.83,24.45 270 top
R6  37.06,24.45 270 top
R7  42.15,10.48 180 top
R8  33.26,10.48 0 top
R9  17.14,10.48 180 top
R10  3.81,23.81 180 top
R11  7.3,24.45 270 top
R12  32.3,24.45 270 top
R13  10.48,24.45 90 top
R14  53.81,23.81 180 top
R15  8.26,10.48 0 top
R16  60.48,24.45 90 top
R17  63.65,24.45 270 top
R18  65.24,24.45 270 top
R19  66.83,24.45 270 top
R20  62.06,24.45 270 top
R21  67.14,10.48 180 top
R22  58.26,10.48 0 top
R23  57.3,24.45 270 top
R24  78.81,23.81 180 top
R25  85.48,24.45 90 top
R26  88.65,24.45 270 top
R27  90.24,24.45 270 top
R28  91.83,24.45 270 top
R29  87.06,24.45 270 top
R30  92.14,10.48 180 top
R31  83.25,10.48 0 top
R32  82.3,24.45 270 top
R33  54.61,33.66 180 top
R34  54.61,35.56 180 top
R35  54.61,31.75 180 top
R41  13.65,24.45 270 top
R42  15.24,24.45 270 top
R43  16.83,24.45 270 top
R44  12.06,24.45 270 top
R49  14.61,32.07 270 top
R50  12.7,32.07 270 top
R51  66.04,46.67 90 top
R61  71.51,24.45 270 top
R62  69.93,24.45 270 top
SJ1  73.19,20.17 90 bottom
SJ2  38.02,20 90 bottom
SJ3  40.24,20 90 bottom
SJ4  42.46,20 90 bottom
SJ5  35.8,20 90 bottom
SJ6  63.02,20 90 bottom
SJ7  65.24,20 90 bottom
SJ8  67.46,20 90 bottom
SJ9  60.8,20 90 bottom
SJ10  13.02,20 90 bottom
SJ11  15.24,20 90 bottom
SJ12  17.46,20 90 bottom
SJ13  10.79,20 90 bottom
SJ14  88.02,20 90 bottom
SJ15  90.24,20 90 bottom
SJ16  92.46,20 90 bottom
SJ17  85.8,20 90 bottom
SJ26  70.79,20.17 90 bottom
TP1  31.67,20.51 180 top
TP2  56.67,20.51 180 top
TP3  81.67,20.51 180 top
TP4  6.35,20.51 180 top
U1  37.7,17.14 180 top
U2  62.7,17.14 180 top
U3  12.7,17.14 180 top
U4  87.7,17.14 180 top
U$4  42.23,46.99 0 top
X1  12.7,1.27 0 bottom
X2  37.7,1.27 0 bottom
X3  62.7,1.27 0 bottom
X4  87.7,1.27 0 bottom
X11  81.92,45.4 180 top
X12  13.97,39.69 180 top
X14  68.58,47.94 270 top

### Tracks (layer width: path | path; a pad name or v marks a point on that pad's centre or on a via)
!MCLR  (via drill 0.6)
  Top 0.254: X14.1 65.78,47.94 R51.2 | IC6.18 63.35,38.58 v64.45,39.69
  Bottom 0.254: v64.45,39.69 64.45,45.72 66.67,47.94 X14.1
D+  (via drill 0.6)
  Top 0.305: IC6.43 40.3,34.58 v40.64,34.92 | v17.46,35.56 16.05,36.98 X12.3
  Bottom 0.305: v40.64,34.92 39.37,36.2 18.1,36.2 v17.46,35.56
D-  (via drill 0.6)
  Top 0.305: IC6.42 39.51,35.38 v40.64,36.51
  Bottom 0.305: X12.2 15.29,34.98 17.14,36.83 40.32,36.83 v40.64,36.51
DIR-1
  Top 0.254: U3.P$19 9.34,16.64 8.89,16.19 6.67,16.19 1.27,21.91 1.27,26.99
  Top 0.305: 1.27,26.99 3.17,28.89 19.05,28.89 20.95,30.8 22.86,30.8 JP4.7 26.67,34.61 30.48,34.61 34.45,38.58 IC6.38
DIR-2
  Top 0.254: U1.P$19 34.34,16.64 33.89,16.19 31.67,16.19 25.95,21.91 25.95,27.3
  Top 0.305: 25.95,27.3 25.95,28.02 25.4,28.57 25.4,30.8 JP4.5 28.57,33.97 31.11,33.97 34.92,37.78 IC6.39
DIR-3
  Top 0.254: U2.P$19 59.34,16.64 58.89,16.19 56.67,16.19 51.27,21.91
  Top 0.305: 51.27,21.91 47.62,25.72 47.14,25.72 45.24,27.62 33.66,27.62 33.02,26.99 29.21,26.99 27.94,28.26 27.94,30.8 JP4.3 30.48,33.34 31.75,33.34 35.4,36.98 IC6.40
DIR-4
  Top 0.254: U4.P$19 84.34,16.64 83.89,16.19 81.67,16.19 76.08,22.09 76.27,21.91
  Top 0.305: 76.08,22.09 76.08,26.48 74.93,27.62 48.58,27.62 47.31,28.89 33.02,28.89 32.38,28.26 31.11,28.26 30.48,28.89 30.48,30.8 JP4.1 35.87,36.18 IC6.41
EN  (via drill 0.51, 0.6)
  Top 0.254: U3.P$2 16.88,16.14 v17.14,15.88 | U1.P$2 41.88,16.14 v42.15,15.88 | U2.P$2 66.88,16.14 v67.14,15.88 | U4.P$2 91.88,16.14 v92.14,15.88 | v70.8,16.83 v70.8,21.91 69.85,22.86 69.85,23.52 R62.2
  Top 0.305: IC6.1 37.23,31.98 36.83,32.38 35.56,32.38 v34.92,31.75 | v21.27,26.99 21.27,18.73 v20.95,18.41
  Bottom 0.254: v17.14,15.88 18.1,16.83 19.37,16.83 20.95,15.24 41.51,15.24 v42.15,15.88 43.73,17.46 53.26,17.46 55.48,15.24 66.51,15.24 v67.14,15.88 68.1,16.83 69.37,16.83 | 69.37,16.83 70.95,15.24 91.51,15.24 v92.14,15.88 | 69.37,16.83 v70.8,16.83 | SJ26.2 70.79,21.89 v70.8,21.91 70.8,21.59 70.8,20.95
  Bottom 0.305: 34.92,31.11 v34.92,31.75 34.92,29.53 32.38,26.99 24.45,26.99 23.5,27.94 22.23,27.94 v21.27,26.99 | v20.95,18.41 19.37,16.83
GND  (via drill 0.38, 0.51)
  Top 0.203: 15.11,16.64 U3.P$3 | 65.11,16.64 U2.P$3 | 40.11,16.64 U1.P$3 | 90.11,16.64 U4.P$3
  Top 0.254: v11.68,17.14 11.75,17.14 | 11.75,17.14 U3.P$29 13.2,16.64 U3.P$3 | 9.02,17.02 9.14,17.14 v11.68,17.14 | v21.59,16.19 21.27,16.51 | U3.P$18 v11.68,17.14 | 11.75,17.14 11.75,18.1 | v61.68,17.14 61.75,17.14 | 61.75,17.14 U2.P$29 63.2,16.64 U2.P$3 | 59.02,17.02 59.14,17.14 v61.68,17.14 | v73.5,16.19 73.18,16.51 | U2.P$18 v61.68,17.14 | 61.75,17.14 61.75,18.1 | v36.68,17.14 36.75,17.14 | 36.75,17.14 U1.P$29 38.2,16.64 U1.P$3 | 34.02,17.02 34.14,17.14 v36.68,17.14 | v46.59,18.73 46.27,19.05 | U1.P$18 v36.68,17.14 | 36.75,17.14 36.75,18.1 | v86.68,17.14 86.75,17.14 | 86.75,17.14 U4.P$29 88.2,16.64 U4.P$3 | 84.02,17.02 84.14,17.14 v86.68,17.14 | U4.P$18 v86.68,17.14 | 86.75,17.14 86.75,18.1
  Top 0.61: v17.14,11.11 17.14,10.48 | 17.14,10.48 R9.1 18.75,11.07 C16.2 | 17.14,10.48 v17.14,9.84 | C17.2 6.65,11.07 | 6.65,11.07 R15.1 | v8.26,11.11 8.26,10.48 | 8.26,10.48 v8.26,9.84 | 6.65,11.07 6.65,10.78 6.35,10.48 8.26,10.48 | v67.14,11.11 67.14,10.48 | 67.14,10.48 R21.1 68.75,11.07 C11.2 | 67.14,10.48 v67.14,9.84 | C18.2 56.65,11.07 | 56.65,11.07 R22.1 | v58.26,11.11 58.26,10.48 | 58.26,10.48 v58.26,9.84 | 56.65,11.07 56.65,10.78 56.35,10.48 58.26,10.48 | v42.15,11.11 42.15,10.48 | 42.15,10.48 R7.1 43.75,11.07 C5.2 | 42.15,10.48 v42.15,9.84 | C6.2 31.65,11.07 | 31.65,11.07 R8.1 | v33.26,11.11 33.26,10.48 | 33.26,10.48 v33.26,9.84 | 31.65,11.07 31.65,10.78 31.35,10.48 33.26,10.48 | v92.14,11.11 92.14,10.48 | 92.14,10.48 R30.1 93.75,11.07 C23.2 | 92.14,10.48 v92.14,9.84 | C24.2 81.65,11.07 | 81.65,11.07 R31.1 | v83.25,11.11 83.25,10.48 | 83.25,10.48 v83.25,9.84 | 81.65,11.07 81.65,10.78 81.35,10.48 83.25,10.48
  Bottom 0.254: SJ12.1 SJ11.1 SJ10.1 | SJ10.1 SJ13.1 | SJ10.1 v12.7,18.16 | SJ8.1 SJ7.1 SJ6.1 | SJ6.1 SJ9.1 | SJ6.1 v62.7,18.16 | SJ4.1 SJ3.1 SJ2.1 | SJ2.1 SJ5.1 | SJ2.1 v37.7,18.16 | SJ16.1 SJ15.1 SJ14.1 | SJ14.1 SJ17.1 | SJ14.1 v87.7,18.16
  other vias: 11.68,18.16 13.72,18.16 12.7,17.14 13.72,17.14 12.7,16.13 13.72,16.13 11.68,16.19 2.54,16.19 1.27,16.19 22.86,16.19 2.54,10.48 1.27,10.48 24.13,10.48 22.86,10.48 7.62,17.14 5.71,23.18 61.68,18.16 63.72,18.16 62.7,17.14 63.72,17.14 62.7,16.13 63.72,16.13 61.68,16.19 52.54,18.73 51.27,18.73 74.77,16.19 52.54,8.57 51.27,8.57 74.13,10.48 72.86,10.48 57.62,17.14 55.72,23.18 36.68,18.16 38.72,18.16 37.7,17.14 38.72,17.14 37.7,16.13 38.72,16.13 36.68,16.19 27.54,16.19 26.27,16.19 47.86,18.73 27.54,10.48 26.27,10.48 49.13,8.57 47.86,8.57 32.62,17.14 30.71,23.18 86.68,18.16 88.72,18.16 87.7,17.14 88.72,17.14 87.7,16.13 88.72,16.13 86.68,16.19 75.95,16.19 95.95,16.83 95.95,21.27 77.54,10.48 76.27,10.48 99.13,10.48 97.86,10.48 82.62,17.14 80.72,22.54 20,21.59 22.54,21.59 25.87,38.42
  pour Top (isolate 0.305, rank 2, no thermals): -5.71,-19.68 109.86,-20.32 109.86,54.61 -5.71,54.61
  pour Bottom (isolate 0.305, rank 2, no thermals): -6.35,-20.95 109.22,-21.59 109.86,54.61 -5.71,54.61
LED1
  Top 0.305: IC6.15 52.72,36.18 53.34,35.56 R34.2
LED2
  Top 0.305: IC6.14 51.98,35.38 R33.2
MS1-1  (via drill 0.6)
  Top 0.254: U3.P$9 13.7,20.25 14.1,20.65 15.25,20.65 v16.83,22.23 R43.2
  Bottom 0.254: SJ12.2 17.46,21.59 v16.83,22.23
MS1-2  (via drill 0.6)
  Top 0.254: U1.P$9 38.7,20.25 39.1,20.65 40.25,20.65 v41.83,22.23 R5.2
  Bottom 0.254: SJ4.2 42.46,21.59 v41.83,22.23
MS1-3  (via drill 0.6)
  Top 0.254: U2.P$9 63.7,20.25 64.1,20.65 65.25,20.65 v66.83,22.23 R19.2
  Bottom 0.254: SJ8.2 67.46,21.59 v66.83,22.23
MS1-4  (via drill 0.6)
  Top 0.254: U4.P$9 88.7,20.25 89.1,20.65 90.25,20.65 v91.83,22.23 R28.2
  Bottom 0.254: SJ16.2 92.46,21.59 v91.83,22.23
MS2-1  (via drill 0.6)
  Top 0.254: U3.P$10 13.2,20.82 13.65,21.27 14.29,21.27 v15.24,22.23 R42.2
  Bottom 0.254: SJ11.2 v15.24,22.23
MS2-2  (via drill 0.6)
  Top 0.254: U1.P$10 38.2,20.82 38.65,21.27 39.29,21.27 v40.24,22.23 R4.2
  Bottom 0.254: SJ3.2 v40.24,22.23
MS2-3  (via drill 0.6)
  Top 0.254: U2.P$10 63.2,20.82 63.65,21.27 64.29,21.27 v65.24,22.23 R18.2
  Bottom 0.254: SJ7.2 v65.24,22.23
MS2-4  (via drill 0.6)
  Top 0.254: U4.P$10 88.2,20.82 88.65,21.27 89.29,21.27 v90.24,22.23 R27.2
  Bottom 0.254: SJ15.2 v90.24,22.23
MS3-1  (via drill 0.6)
  Top 0.254: U3.P$11 12.7,21.27 v13.65,22.23 R41.2
  Bottom 0.254: SJ10.2 13.02,21.59 v13.65,22.23
MS3-2  (via drill 0.6)
  Top 0.254: U1.P$11 37.7,21.27 v38.65,22.23 R3.2
  Bottom 0.254: SJ2.2 38.02,21.59 v38.65,22.23
MS3-3  (via drill 0.6)
  Top 0.254: U2.P$11 62.7,21.27 v63.65,22.23 R17.2
  Bottom 0.254: SJ6.2 63.02,21.59 v63.65,22.23
MS3-4  (via drill 0.6)
  Top 0.254: U4.P$11 87.7,21.27 v88.65,22.23 R26.2
  Bottom 0.254: SJ14.2 88.02,21.59 v88.65,22.23
N$1
  Top 0.254: U3.P$27 13.7,13.29 14.29,12.7 | R9.2 15.24,10.79
  Top 0.61: 14.29,12.7 14.29,11.13 R9.2
N$2
  Top 0.254: U1.P$6 40.92,18.14 41.19,18.41 41.19,19.37 42.15,20.32 43.73,20.32 44.37,19.68 C2.1
N$3
  Top 0.254: U1.P$8 40.42,19.55 41.83,20.95 42.15,20.95 43.48,22.29 43.48,23.73 C3.1
N$4
  Top 0.254: U3.P$23 11.7,13.29 11.11,12.7 | 11.11,11.45 R15.2
  Top 0.61: 11.11,12.7 11.11,11.45 11.11,11.11 10.16,10.16
N$5
  Top 0.254: R11.1 5.01,25.3 R10.1
N$6
  Top 0.254: U1.P$13 36.7,21 35.8,21.91 35.8,23.5 35.48,23.81 R2.1 35.48,23.5
N$7  (via drill 0.6)
  Top 0.254: U1.P$17 33.71,17.64 32.94,18.41 v31.98,18.41 | TP1.P$1 31.48,20.83 | 28.81,22.23 R1.2
  Top 0.305: TP1.P$1 30.52,20.51 v30.08,20.95 30.08,21.09 R1.2
  Bottom 0.254: v31.98,18.41 30.08,20.32 v30.08,20.95
N$8
  Top 0.254: U1.P$4 42.16,17.14 C1.1
N$9
  Top 0.254: U1.P$5 41.38,17.64 41.83,18.1 41.83,18.41 42.46,19.05 42.78,19.05 42.77,19.07 42.54,19.07 C1.2
N$10
  Top 0.254: U1.P$24 37.2,12.58 37.19,12.57
  Top 0.61: X2.3 37.19,8.38 37.19,12.57
N$11
  Top 0.254: U1.P$26 38.2,12.58 38.21,12.57
  Top 0.61: X2.2 38.21,8.38 38.21,12.57
N$12
  Top 0.254: U1.P$1 40.39,15.63 40.62,15.48
  Top 0.61: X2.1 46.27,7.3 46.27,13.02 44.69,14.61 41.5,14.61 40.62,15.48
N$13
  Top 0.254: U1.P$21 34.94,15.63 34.72,15.48
  Top 0.61: 34.72,15.48 34.72,15.43 33.89,14.61 30.71,14.61 29.13,13.02 29.13,7.3 X2.4
N$14
  Top 0.254: U1.P$27 38.7,13.29 39.29,12.7 | R7.2 40.24,10.79
  Top 0.61: 39.29,12.7 39.29,11.13 R7.2
N$15
  Top 0.254: U1.P$23 36.7,13.29 36.11,12.7 | 36.11,11.45 R8.2
  Top 0.61: 36.11,12.7 36.11,11.45 36.11,11.11 35.16,10.16
N$16
  Top 0.254: R12.1 30.01,25.3 R1.1
N$17
  Top 0.254: U2.P$6 65.92,18.14 66.19,18.41 66.19,19.37 67.14,20.32 68.73,20.32 69.37,19.68 C8.1
N$18
  Top 0.254: U2.P$8 65.42,19.55 66.83,20.95 67.14,20.95 68.48,22.29 68.48,23.73 C9.1
N$19
  Top 0.254: U3.P$6 15.92,18.14 16.19,18.41 16.19,19.37 17.14,20.32 18.73,20.32 19.37,19.68 C13.1
N$20
  Top 0.254: U3.P$8 15.42,19.55 16.83,20.95 17.14,20.95 18.48,22.29 18.48,23.73 C14.1
N$21
  Top 0.254: U3.P$13 11.7,21 10.79,21.91 10.79,23.5 10.48,23.81 R13.1 10.48,23.5
N$22  (via drill 0.6)
  Top 0.254: U3.P$17 8.71,17.64 7.94,18.41 v6.99,18.41 | TP4.P$1 5.84,20.51 v5.08,21.27 | 3.81,22.23 R10.2
  Top 0.305: R10.2 3.99,22.36 v5.08,21.27
  Bottom 0.254: v6.99,18.41 5.08,20.32 v5.08,21.27
N$23
  Top 0.254: U3.P$4 17.16,17.14 C12.1
N$24
  Top 0.254: U2.P$13 61.7,21 60.8,21.91 60.8,23.5 60.48,23.81 R16.1 60.48,23.5
N$25
  Top 0.254: U3.P$5 16.38,17.64 16.83,18.1 16.83,18.41 17.46,19.05 17.78,19.05 17.77,19.07 17.54,19.07 C12.2
N$26  (via drill 0.6)
  Top 0.254: U2.P$17 58.71,17.64 57.94,18.41 v56.98,18.41 | TP2.P$1 56.48,20.83 | 53.81,22.23 R14.2
  Top 0.305: TP2.P$1 55.52,20.51 v55.08,20.95 55.08,21.09 R14.2
  Bottom 0.254: v56.98,18.41 55.08,20.32 v55.08,20.95
N$27
  Top 0.305: LED3.A R35.1
N$28
  Top 0.254: U3.P$21 9.94,15.63 9.72,15.48
  Top 0.61: 9.72,15.48 9.72,15.43 8.89,14.61 5.71,14.61 4.13,13.02 4.13,7.3 X1.4
N$29
  Top 0.254: U3.P$24 12.2,12.58 12.19,12.57
  Top 0.61: X1.3 12.19,8.38 12.19,12.57
N$30
  Top 0.254: U3.P$26 13.2,12.58 13.21,12.57
  Top 0.61: X1.2 13.21,8.38 13.21,12.57
N$31
  Top 0.254: U3.P$1 15.39,15.63 15.62,15.48
  Top 0.61: X1.1 21.27,7.3 21.27,13.02 19.68,14.61 16.5,14.61 15.62,15.48
N$32
  Top 0.254: U2.P$4 67.16,17.14 C7.1
N$33
  Top 0.254: U2.P$5 66.38,17.64 66.83,18.1 66.83,18.41 67.46,19.05 67.78,19.05 67.77,19.07 67.54,19.07 C7.2
N$34
  Top 0.254: U2.P$24 62.2,12.58 62.19,12.57
  Top 0.61: X3.3 62.19,8.38 62.19,12.57
N$35
  Top 0.254: U2.P$26 63.2,12.58 63.21,12.57
  Top 0.61: X3.2 63.21,8.38 63.21,12.57
N$36
  Top 0.254: U2.P$1 65.39,15.63 65.62,15.48
  Top 0.61: X3.1 71.27,7.3 71.27,13.02 69.69,14.61 66.5,14.61 65.62,15.48
N$37
  Top 0.254: U2.P$21 59.94,15.63 59.72,15.48
  Top 0.61: 59.72,15.48 59.72,15.43 58.89,14.61 55.72,14.61 54.13,13.02 54.13,7.3 X3.4
N$38
  Top 0.254: U2.P$27 63.7,13.29 64.29,12.7 | R21.2 65.24,10.79
  Top 0.61: 64.29,12.7 64.29,11.13 R21.2
N$39
  Top 0.254: U2.P$23 61.7,13.29 61.11,12.7 | 61.11,11.45 R22.2
  Top 0.61: 61.11,12.7 61.11,11.45 61.11,11.11 60.16,10.16
N$40
  Top 0.254: R23.1 55.01,25.3 R14.1
N$41
  Top 0.254: U4.P$6 90.92,18.14 91.19,18.41 91.19,19.37 92.14,20.32 93.73,20.32 94.37,19.68 C20.1
N$42
  Top 0.254: U4.P$8 90.42,19.55 91.83,20.95 92.14,20.95 93.48,22.29 93.48,23.73 C21.1
N$43
  Top 0.254: U4.P$13 86.7,21 85.8,21.91 85.8,23.5 85.48,23.81 R25.1 85.48,23.5
N$44  (via drill 0.6)
  Top 0.254: U4.P$17 83.71,17.64 82.94,18.41 v81.98,18.41 | TP3.P$1 81.48,20.83 | 78.81,22.23 R24.2
  Top 0.305: TP3.P$1 80.53,20.51 v80.08,20.95 80.08,21.09 R24.2
  Bottom 0.254: v81.98,18.41 80.08,20.32 v80.08,20.95
N$45
  Top 0.254: U4.P$4 92.16,17.14 C19.1
N$46
  Top 0.254: U4.P$5 91.38,17.64 91.83,18.1 91.83,18.41 92.46,19.05 92.78,19.05 92.77,19.07 92.54,19.07 C19.2
N$47
  Top 0.254: U4.P$24 87.2,12.58 87.19,12.57
  Top 0.61: X4.3 87.19,8.38 87.19,12.57
N$48
  Top 0.254: U4.P$26 88.2,12.58 88.21,12.57
  Top 0.61: X4.2 88.21,8.38 88.21,12.57
N$49
  Top 0.254: U4.P$1 90.39,15.63 90.62,15.48
  Top 0.61: X4.1 96.27,7.3 96.27,13.02 94.69,14.61 91.5,14.61 90.62,15.48
N$50
  Top 0.254: U4.P$21 84.94,15.63 84.72,15.48
  Top 0.61: 84.72,15.48 84.72,15.43 83.89,14.61 80.72,14.61 79.13,13.02 79.13,7.3 X4.4
N$51
  Top 0.254: U4.P$27 88.7,13.29 89.29,12.7 | R30.2 90.24,10.79
  Top 0.61: 89.29,12.7 89.29,11.13 R30.2
N$52
  Top 0.254: U4.P$23 86.7,13.29 86.11,12.7 | 86.11,11.45 R31.2
  Top 0.61: 86.11,12.7 86.11,11.45 86.11,11.11 85.16,10.16
N$53
  Top 0.254: R32.1 80.01,25.3 R24.1
N$54
  Top 0.305: R33.1 LED1.A
N$73
  Top 0.305: R34.1 LED2.A
OSC1
  Top 0.254: IC6.30 42.22,46.98 43.18,47.94 43.81,47.94 43.77,47.99 U$4.3 45.25,47.99 C42.1
OSC2
  Top 0.254: C40.1 38.57,45.99 U$4.1 41.41,45.45 IC6.31
PGC
  Top 0.254: X14.5 66.67,37.78 66.36,37.47 65.88,36.98 IC6.16
PGD
  Top 0.254: IC6.17 65.41,37.78 67.94,40.32 X14.4
RA0
  Top 0.305: JP5.8 60.96,46.67 60.96,44.13 56.21,39.38 IC6.19
RA1
  Top 0.305: IC6.20 55.74,40.18 59.69,44.13 JP5.7
RA2
  Top 0.305: JP5.6 58.42,46.67 58.42,44.13 55.24,40.96 49.64,40.96 IC6.21
RA3
  Top 0.305: IC6.22 54.8,41.78 57.15,44.13 JP5.5
RA4
  Top 0.305: IC6.23 48.49,43.58 48.58,43.5 53.98,43.5 54.61,44.13 JP5.3
RA5
  Top 0.305: IC6.24 47.02,42.52 47.31,42.23 48.26,42.23 48.58,42.55 54.29,42.55 55.88,44.13 55.88,46.67 JP5.4
RC0
  Top 0.305: IC6.32 40.62,42.52 40.32,42.23 39.37,42.23 38.73,42.86 34.61,42.86 31.75,45.72 29.84,45.72 JP2.3
RC1
  Top 0.305: IC6.35 33.31,40.98 31.11,43.18 JP2.2
RC2
  Top 0.305: IC6.36 32.84,40.18 JP2.4
RE0
  Top 0.305: IC6.25 46.22,44.31 46.67,44.77 51.44,44.77 JP5.1
RE1
  Top 0.305: IC6.26 45.41,44.46 46.35,45.4 49.53,45.4 JP5.2
RE2  (via drill 0.6)
  Top 0.305: IC6.27 44.62,42.06 v45.09,41.59
  Bottom 0.305: v45.09,41.59 39.69,46.99 JP2.1
RST-1  (via drill 0.6)
  Top 0.254: U3.P$12 12.2,22.09 v12.06,22.23 R44.2
  Bottom 0.254: 10.79,20.57 SJ13.2 10.93,20.45 12.06,21.59 v12.06,22.23
RST-2  (via drill 0.6)
  Top 0.254: U1.P$12 37.2,22.09 v37.06,22.23 R6.2
  Bottom 0.254: 35.8,20.57 SJ5.2 35.93,20.45 37.06,21.59 v37.06,22.23
RST-3  (via drill 0.6)
  Top 0.254: U2.P$12 62.2,22.09 v62.06,22.23 R20.2
  Bottom 0.254: 60.8,20.57 SJ9.2 60.93,20.45 62.06,21.59 v62.06,22.23
RST-4  (via drill 0.6)
  Top 0.254: U4.P$12 87.2,22.09 v87.06,22.23 R29.2
  Bottom 0.254: 85.8,20.57 SJ17.2 85.93,20.45 87.06,21.59 v87.06,22.23
SLP  (via drill 0.6)
  Top 0.254: U3.P$14 11.2,20.23 v9.84,21.59 | U4.P$14 86.2,20.23 v84.84,21.59 | U2.P$14 61.2,20.23 v59.84,21.59 | U1.P$14 36.2,20.23 v34.84,21.59 | R61.2 71.51,23.42 v73.03,21.91
  Top 0.305: IC6.2 40.62,31.09 40.01,30.48 36.83,30.48 v36.2,31.11 | v22.86,26.67 v22.86,23.81
  Bottom 0.254: v9.84,21.59 9.84,23.5 10.79,24.45 23.18,24.45 31.35,24.45 32.3,23.5 32.3,20.95 32.62,20.64 33.89,20.64 v34.84,21.59 34.84,24.77 35.8,25.72 45.4,25.72 46.35,24.77 48.26,24.77 49.21,25.72 56.35,25.72 57.3,24.77 57.3,20.95 57.62,20.64 58.89,20.64 v59.84,21.59 59.84,24.77 60.8,25.72 69.22,25.72 70.8,24.13 | 85.8,25.72 84.84,24.77 v84.84,21.59 83.89,20.64 82.62,20.64 82.3,20.95 82.3,23.11 81.28,24.13 70.8,24.13 | v73.03,21.91 73.03,20.78 SJ1.2 73.05,20.62 73.03,20.64 v73.03,21.91 | v73.03,21.91 70.8,24.13
  Bottom 0.305: v36.2,31.11 36.2,29.84 32.7,26.35 23.18,26.35 v22.86,26.67 | v22.86,23.81 22.86,24.13 23.18,24.45
STP-1  (via drill 0.6)
  Top 0.254: U3.P$16 9.16,18.14 7.94,19.37 4.76,19.37 1.91,22.23 1.91,26.35
  Top 0.305: JP4.8 22.86,28.26 3.81,28.26 1.91,26.35 | IC6.8 45.41,33.96 v44.77,34.61
  Bottom 0.305: JP4.8 25.4,30.8 25.4,32.7 26.04,33.34 43.5,33.34 v44.77,34.61
STP-2  (via drill 0.6)
  Top 0.254: U1.P$16 34.16,18.14 32.94,19.37 29.45,19.37 26.59,22.23 26.59,28.57
  Top 0.305: 26.59,28.57 26.59,29.45 JP4.6 | IC6.9 46.22,35.38 v45.72,35.88
  Bottom 0.305: v45.72,35.88 46.04,35.56 46.04,34.29 44.45,32.7 34.29,32.7 32.38,30.8 27.94,30.8 JP4.6
STP-3  (via drill 0.6)
  Top 0.254: U2.P$16 59.16,18.14 57.94,19.37 54.76,19.37 51.99,22.14 51.91,22.23
  Top 0.305: 51.99,22.14 v47.23,27.22 46.19,28.26 33.34,28.26 32.7,27.62 30.48,27.62 29.21,28.89 JP4.4 | IC6.10 47.02,35.53 v47.31,35.88
  Bottom 0.305: v47.31,35.88 47.31,27.3 v47.23,27.22
STP-4
  Top 0.254: U4.P$16 84.16,18.14 82.94,19.37 79.76,19.37 76.91,22.23
  Top 0.305: 76.91,22.23 76.91,26.6 75.25,28.26 49.21,28.26 47.94,29.53 | 47.94,29.53 JP4.2 | IC6.11 47.81,29.66 47.94,29.53
USB_SENSE  (via drill 0.6)
  Top 0.305: IC6.44 37.02,33.78 v36.2,34.61 | v17.14,32.7 15.56,31.11 14.61,31.11 R49.2
  Bottom 0.305: v36.2,34.61 19.05,34.61 v17.14,32.7
VBUS
  Top 0.305: X12.1 12.72,32.99 | 12.72,32.99 R50.1 | 12.72,32.99 14.59,32.99 R49.1
VCC  (via drill 0.51, 0.6)
  Top 0.254: 8.89,13.34 9.53,13.97 | 9.53,13.97 10.3,14.74 U3.P$22 10.43,13.97 v10.16,13.97 | 16.51,13.34 15.1,14.74 U3.P$28 14.46,14.74 v15.24,13.97 | C13.2 19.37,16.51 v18.73,15.88 | v9.53,13.02 9.53,13.97 | 83.89,13.34 84.53,13.97 | 84.53,13.97 85.3,14.74 U4.P$22 85.42,13.97 v85.16,13.97 | 91.51,13.34 90.1,14.74 U4.P$28 89.47,14.74 v90.24,13.97 | C20.2 94.37,16.51 v93.73,15.88 | v84.53,13.02 84.53,13.97 | 58.89,13.34 59.52,13.97 | 59.52,13.97 60.3,14.74 U2.P$22 60.42,13.97 v60.16,13.97 | 66.51,13.34 65.1,14.74 U2.P$28 64.47,14.74 v65.24,13.97 | C8.2 69.37,16.51 v68.73,15.88 | v59.52,13.02 59.52,13.97 | 33.89,13.34 34.52,13.97 | 34.52,13.97 35.3,14.74 U1.P$22 35.42,13.97 v35.16,13.97 | 41.51,13.34 40.1,14.74 U1.P$28 39.47,14.74 v40.24,13.97 | C2.2 44.37,16.51 v43.73,15.88 | v34.52,13.02 34.52,13.97
  Top 0.61: C17.1 v9.53,13.02 | C16.1 v15.88,13.02 | C24.1 v84.53,13.02 | C23.1 v90.88,13.02 | C18.1 v59.52,13.02 | C11.1 v65.88,13.02 | C6.1 v34.52,13.02 | C5.1 v40.88,13.02
  Top 0.813: C35.+ 87.26,32.07 C36.2
  Top 1.27: IC3.3 95.66,28.57 v98.11,28.57
  Top 2.54: C35.+ 84.89,40.32 X11.2
  Bottom 0.254: v15.24,13.97 v10.16,13.97 | v18.73,15.88 18.73,13.34 | v90.24,13.97 v85.16,13.97 68.65,13.34 | v93.73,15.88 93.73,13.34 | v65.24,13.97 v60.16,13.97 | v68.73,15.88 68.73,13.34 | v40.24,13.97 v35.16,13.97 9.76,13.34 | v43.73,15.88 43.73,13.34
  Bottom 0.406: 68.65,13.34 65.88,13.34 v65.88,13.02
  Bottom 0.813: v9.53,13.02 9.53,13.1 9.76,13.34
  Bottom 2.54: 9.76,13.34 18.73,13.34 43.73,13.34 45.72,13.34 47.94,15.56 52.39,15.56 54.61,13.34 68.65,13.34 68.73,13.34 93.73,13.34 98.11,13.34 v98.11,28.57 98.11,40.32 X11.1 X11.2
  pour Top (no thermals): 11.25,15.19 11.25,14.12 9.6,12.47 8.48,12.47 8.23,12.73 10.72,15.21 11.23,15.21
  pour Top (no thermals): 14.15,15.21 14.15,14.07 15.75,12.47 16.66,12.47 17.12,12.93 14.83,15.21
  pour Top (no thermals): 86.25,15.19 86.25,14.12 84.6,12.47 83.48,12.47 83.23,12.73 85.72,15.21 86.23,15.21
  pour Top (no thermals): 89.15,15.21 89.15,14.07 90.75,12.47 91.66,12.47 92.12,12.93 89.83,15.21
  pour Top (no thermals): 61.25,15.19 61.25,14.12 59.6,12.47 58.48,12.47 58.23,12.73 60.72,15.21 61.23,15.21
  pour Top (no thermals): 64.15,15.21 64.15,14.07 65.75,12.47 66.66,12.47 67.12,12.93 64.83,15.21
  pour Top (no thermals): 36.25,15.19 36.25,14.12 34.6,12.47 33.48,12.47 33.23,12.73 35.72,15.21 36.23,15.21
  pour Top (no thermals): 39.15,15.21 39.15,14.07 40.75,12.47 41.66,12.47 42.12,12.93 39.83,15.21
VOUT  (via drill 0.51, 0.6)
  Top 0.254: R43.1 R42.1 R41.1 R44.1 13.23,25.3 13.34,25.4 v13.34,26.67 | U3.P$15 9.93,18.64 9.53,19.05 | 8.26,23.5 8.26,23.6 | R11.2 8.79,23.6 8.89,23.5 | R19.1 R18.1 R17.1 R20.1 63.23,25.3 63.34,25.4 v63.34,26.67 | U2.P$15 59.93,18.64 59.52,19.05 | 58.26,23.5 58.26,23.6 | R23.2 58.79,23.6 58.89,23.5 | R28.1 R27.1 R26.1 R29.1 88.23,25.3 88.33,25.4 v88.33,26.67 | U4.P$15 84.93,18.64 84.53,19.05 | 83.25,23.5 83.25,23.6 | R32.2 83.79,23.6 83.89,23.5 | R5.1 R4.1 R3.1 R6.1 38.23,25.3 38.34,25.4 v38.34,26.67 | U1.P$15 34.93,18.64 34.52,19.05 | 33.26,23.5 33.26,23.6 | R12.2 33.79,23.6 33.89,23.5 | 65.78,45.4 R51.1 | 69.85,25.4 v73.03,25.4 | C33.2 53.71,31.38 53.34,31.75 | R35.2 53.98,31.75
  Top 0.305: R35.2 53.34,31.75 v52.07,31.75 | R61.1 R62.1 69.95,25.3 69.85,25.4 71.75,25.4
  Top 0.406: IC6.28 43.81,37.78 | IC6.7 44.62,33.17 43.18,34.61 43.18,35.24 43.81,35.88 43.81,37.78 | 43.81,37.78 v46.35,37.78
  Top 0.61: 9.53,19.05 8.26,20.32 v8.26,21.59 | 12.06,25.08 R44.1 12.06,25.4 | 59.52,19.05 58.26,20.32 v58.26,21.59 | 62.06,25.08 R20.1 62.06,25.4 | 84.53,19.05 83.25,20.32 v83.25,21.59 | 87.06,25.08 R29.1 87.06,25.4 | 34.52,19.05 33.26,20.32 v33.26,21.59 | 37.06,25.08 R6.1 37.06,25.4
  Top 0.813: v8.26,21.59 8.26,23.5 | R11.2 8.26,23.6 C15.1 | v58.26,21.59 58.26,23.5 | R23.2 58.26,23.6 C10.1 | v83.25,21.59 83.25,23.5 | R32.2 83.25,23.6 C22.1 | v33.26,21.59 33.26,23.5 | R12.2 33.26,23.6 C4.1 | 65.78,45.4 X14.2 64.77,45.4 JP5.10 | JP2.6 25.4,44.45 22.86,41.91 22.86,33.34 JP4.9 | IC3.2 93.34,27.3 92.71,26.67 v88.33,26.67 | C34.2 92.52,34.34 IC3.4
  Top 1.27: IC3.4 IC3.2
  Bottom 0.254: 67.63,45.4 X14.2 | v73.03,25.4 73.03,26.67
  Bottom 0.305: v52.07,31.75 48.58,31.75
  Bottom 0.61: v8.26,21.59 8.26,26.67 13.25,26.67 | v58.26,21.59 58.26,26.67 63.25,26.67 | v83.25,21.59 83.25,26.67 v88.33,26.67 | v33.26,21.59 33.26,25.4 34.29,26.67
  Bottom 0.813: 13.25,26.67 v13.34,26.67 14.61,25.4 19.68,25.4 | 48.9,26.67 63.25,26.67 v63.34,26.67 73.03,26.67 v88.33,26.67 | 48.9,26.67 47.94,25.72 46.67,25.72 45.72,26.67 v38.34,26.67 34.29,26.67 33.02,25.4 19.68,25.4 | JP4.9 19.68,30.16 19.68,25.4 | v46.35,37.78 48.58,37.78 | 48.58,37.78 48.58,31.75 48.58,26.99 48.9,26.67 | 48.58,37.78 65.41,37.78 66.04,38.42 66.04,43.81 67.63,45.4
VUSB
  Top 0.305: IC6.37 31.13,39.38 31.11,39.37 31.17,39.32 C39.1 C38.1 C37.1

### Text on the board
tValues: Barrel Jack
tDocu: ICSP | LED1 | USB | 1 | 2 | 3 | 4 | LED2 | DIR | POWER | STEP
bDocu: RST | MS3 | MS2 | MS1 | RST | MS3 | MS2 | MS1 | RST | MS3 | MS2 | MS1 | EN | SLP | RST | MS3 | MS2 | MS1